# Altium project ETR_CELLMETER_SLAVE.PrjPcb (part 1 of 3)
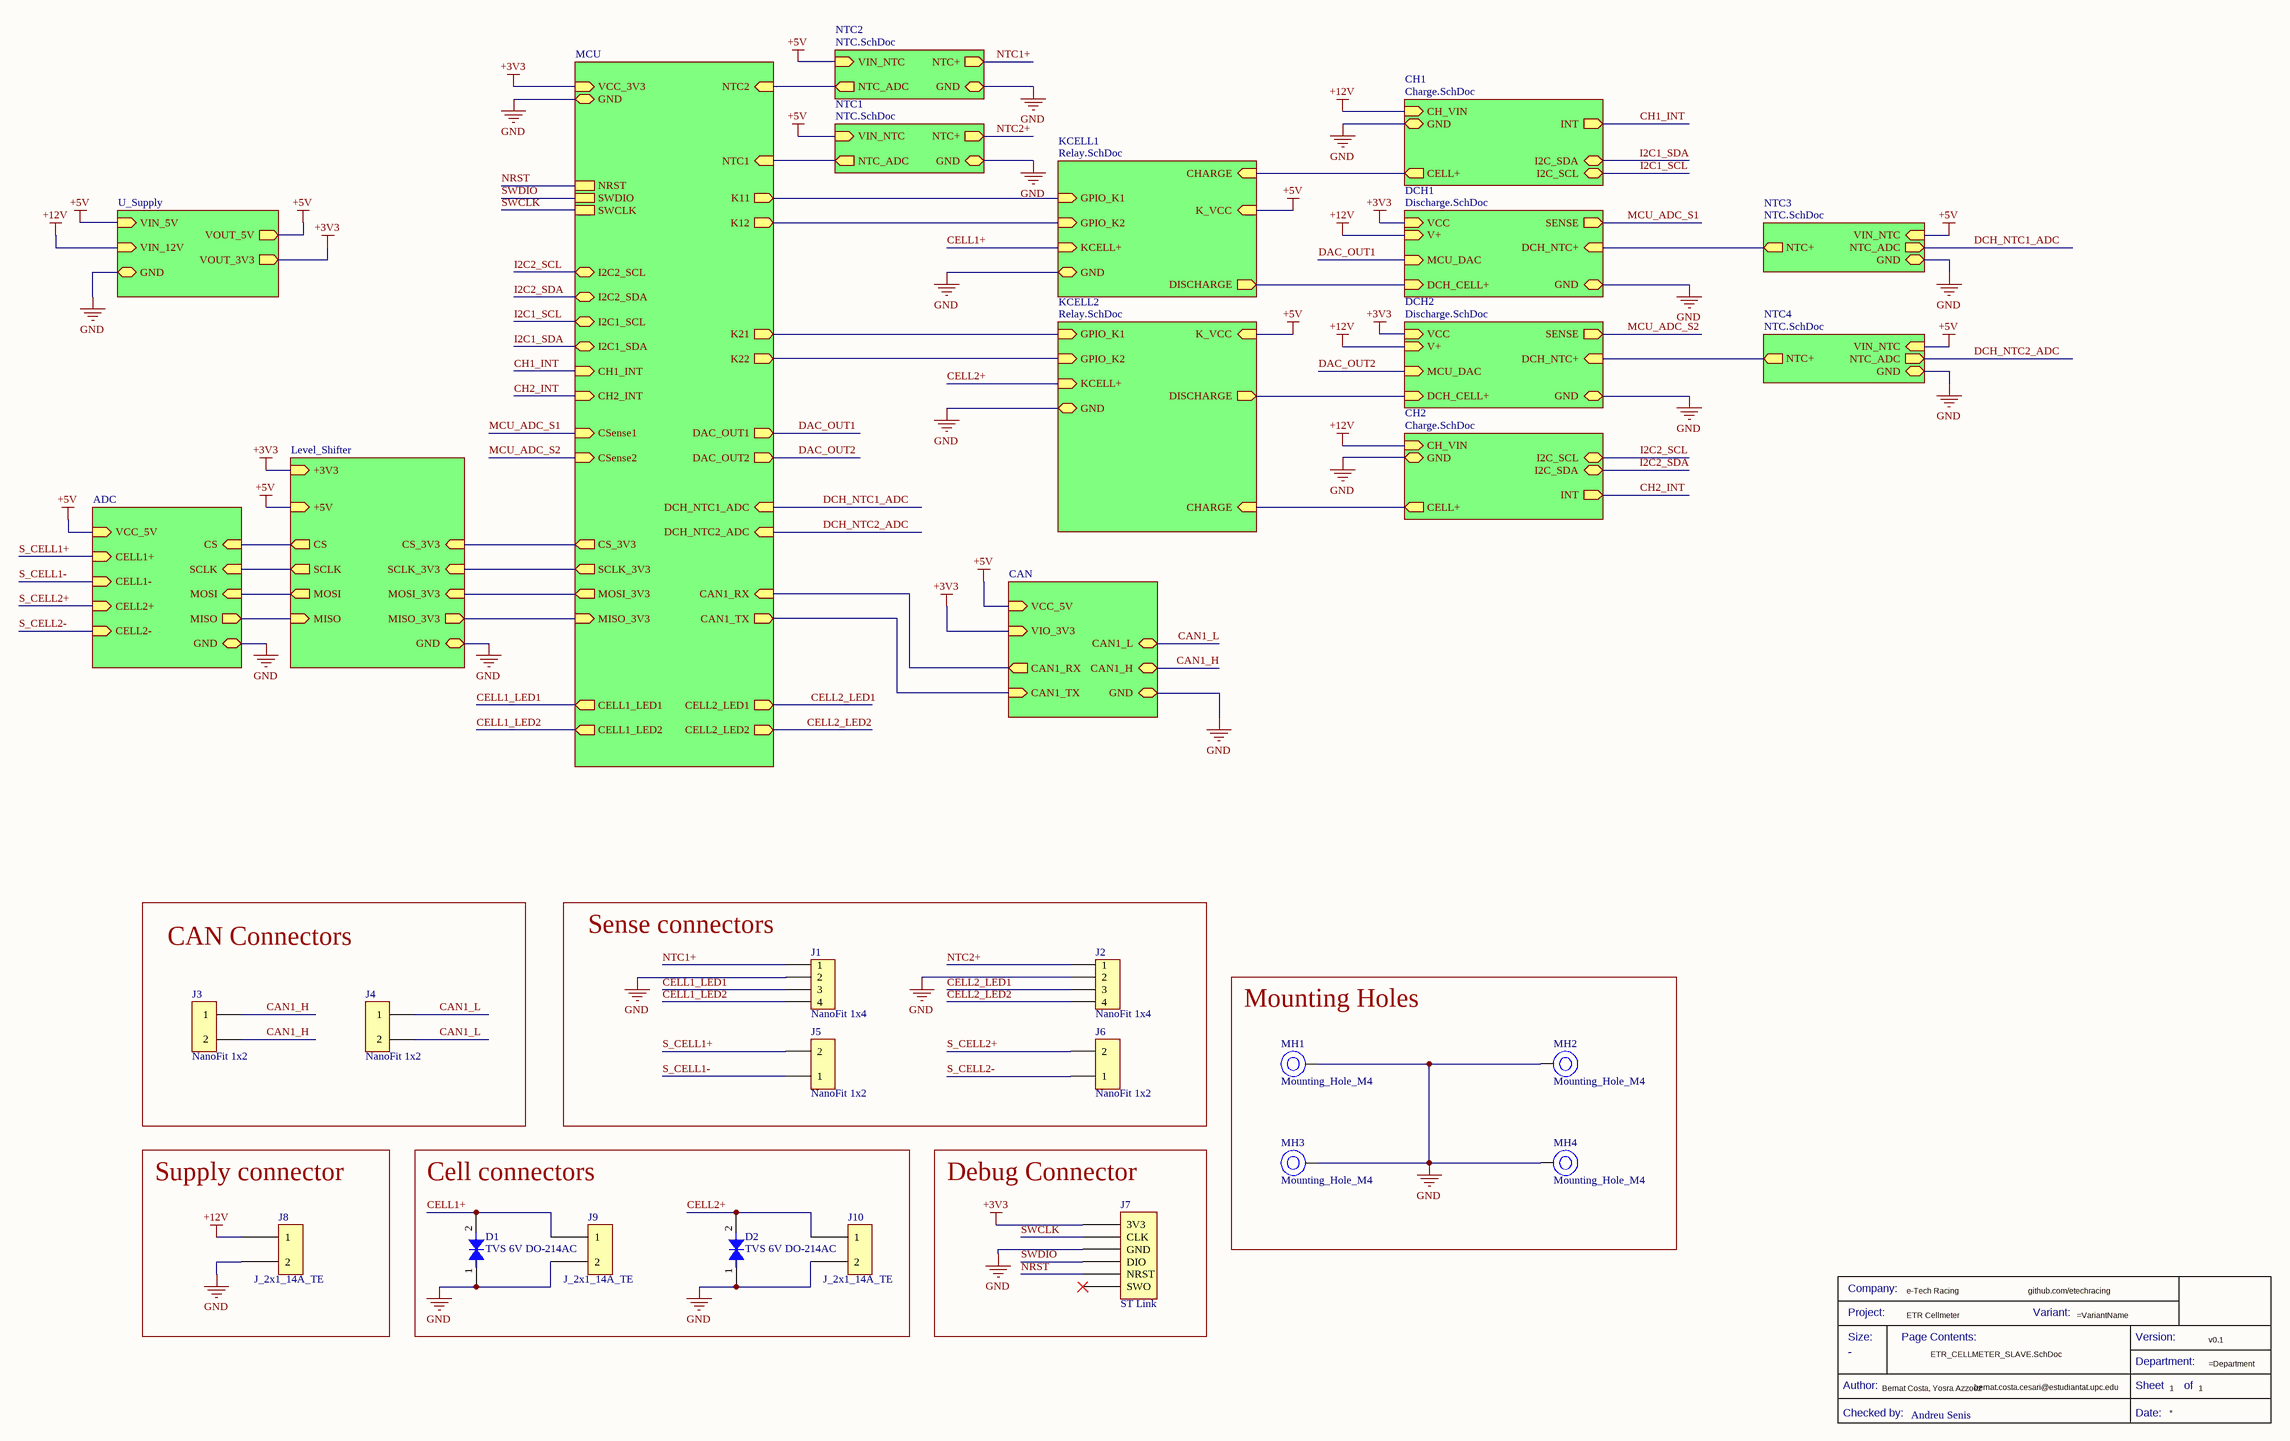
[diagram p0: ETR_CELLMETER_SLAVE.SchDoc]
Company: e-Tech Racing; Date: 08/10/2024; Departament: ECUs; DesignedByURL: github.com/etechracing; DesignerMail: bernat.costa.cesari@estudiantat.upc.edu; DesignerName: Bernat Costa, Yosra Azzouz; Project: ETR Cellmeter; ReviewerName: Andreu Senis; Size: A4; Variant: 0; Version: v0.1
10 sheets, 220 parts. Net scope: strictly hierarchical (ports join the sheet entries above them; power ports are local).
Board file: ETR_CELLMETER_SLAVE.PcbDoc
Sheets:
  ETR_CELLMETER_SLAVE.SchDoc
    ADC = ADC.SchDoc
    Level_Shifter = Level_Shifter.SchDoc
    CAN = CAN.SchDoc
    MCU = MCU.SchDoc
    U_Supply = Supply.SchDoc
    KCELL1 = Relay.SchDoc
    KCELL2 = Relay.SchDoc
    DCH1 = Discharge.SchDoc
    DCH2 = Discharge.SchDoc
    CH2 = Charge.SchDoc
    CH1 = Charge.SchDoc
    NTC1 = NTC.SchDoc
    NTC2 = NTC.SchDoc
    NTC4 = NTC.SchDoc
    NTC3 = NTC.SchDoc

## Sheet ETR_CELLMETER_SLAVE.SchDoc
size A2; SheetNumber: 1; SheetTotal: 1

### Parts
(Parts that share a designator on the sheet are numbered #1, #2 ... from top to bottom, then left to right.)
*#1  Checked by:: Andreu Senis  (hidden comment: Title Block_template)  (graphical)
D1  TVS 6V DO-214AC  [DTVS-DO-214AC]
D2  TVS 6V DO-214AC  [DTVS-DO-214AC]
J1  NanoFit 1x4  [J_NanoFit_1x4_V]
J2  NanoFit 1x4  [J_NanoFit_1x4_V]
J3  NanoFit 1x2  [FP-105309-1102-MFG]
J4  NanoFit 1x2  [FP-105309-1102-MFG]
J5  NanoFit 1x2  [FP-105309-1102-MFG]
J6  NanoFit 1x2  [FP-105309-1102-MFG]
J7  ST Link  [J_STLink_PinHeader]
J8  J_2x1_14A_TE  [179838-2]
J9  J_2x1_14A_TE  [179838-2]
J10  J_2x1_14A_TE  [179838-2]
MH1  Mounting_Hole_M4  [Mounting_Hole_M4]
MH2  Mounting_Hole_M4  [Mounting_Hole_M4]
MH3  Mounting_Hole_M4  [Mounting_Hole_M4]
MH4  Mounting_Hole_M4  [Mounting_Hole_M4]

### Blocks framed on the sheet
CAN Connectors: J3 J4
Sense connectors: J1 J2 J5 J6
Mounting Holes: MH1-MH4
Supply connector: J8
Cell connectors: D1 D2 J9 J10
Debug Connector: J7

### Sub-sheets
ADC = ADC: SCLK (in), CS (in), MOSI (in), MISO (out), CELL2+ (in), CELL2- (in), CELL1- (in), CELL1+ (in), VCC_5V (in), GND (bidir)
CAN = CAN.SchDoc: CAN1_L (bidir), CAN1_H (bidir), CAN1_RX (out), CAN1_TX (in), VCC_5V (in), VIO_3V3 (in), GND (bidir)
CH1 = Charge.SchDoc: CELL+ (out), CH_VIN (in), INT (out), I2C_SCL (bidir), I2C_SDA (bidir), GND (bidir)
CH2 = Charge.SchDoc: CELL+ (out), CH_VIN (in), INT (out), I2C_SCL (bidir), I2C_SDA (bidir), GND (bidir)
DCH1 = Discharge.SchDoc: SENSE (out), VCC (in), V+ (in), MCU_DAC (in), DCH_CELL+ (in), GND (bidir), DCH_NTC+ (in)
DCH2 = Discharge.SchDoc: SENSE (out), VCC (in), V+ (in), MCU_DAC (in), DCH_CELL+ (in), GND (bidir), DCH_NTC+ (in)
KCELL1 = Relay.SchDoc: GPIO_K2 (in), GPIO_K1 (in), KCELL+ (in), DISCHARGE (out), CHARGE (in), GND (bidir), K_VCC (in)
KCELL2 = Relay.SchDoc: GPIO_K2 (in), GPIO_K1 (in), KCELL+ (in), DISCHARGE (out), CHARGE (in), GND (bidir), K_VCC (in)
Level_Shifter = Level_Shifter: MISO_3V3 (out), MOSI (out), CS (out), SCLK (out), CS_3V3 (in), MOSI_3V3 (in), SCLK_3V3 (in), +3V3 (in), +5V (in), MISO (in), GND (bidir)
MCU = MCU: VCC_3V3 (in), NRST, K11 (out), K12 (out), CAN1_RX (in), CAN1_TX (out), K22 (out), K21 (out), CS_3V3 (out), DAC_OUT1 (out), DAC_OUT2 (out), SWDIO, SWCLK, I2C1_SCL (bidir), I2C1_SDA (bidir), SCLK_3V3 (out), MISO_3V3 (in), MOSI_3V3 (out), GND (bidir), NTC1 (in), NTC2 (in), I2C2_SCL (bidir), I2C2_SDA (bidir), CH1_INT (in), CH2_INT (in), CSense1 (in), CSense2 (in), DCH_NTC1_ADC (in), DCH_NTC2_ADC (in), CELL1_LED1 (out), CELL1_LED2 (out), CELL2_LED1 (out), CELL2_LED2 (out)
NTC1 = NTC.SchDoc: VIN_NTC (in), NTC_ADC (out), NTC+ (out), GND (bidir)
NTC2 = NTC.SchDoc: VIN_NTC (in), NTC_ADC (out), NTC+ (out), GND (bidir)
NTC3 = NTC.SchDoc: NTC+ (out), VIN_NTC (in), NTC_ADC (out), GND (bidir)
NTC4 = NTC.SchDoc: NTC+ (out), VIN_NTC (in), NTC_ADC (out), GND (bidir)
U_Supply = Supply.SchDoc: VIN_12V (in), VOUT_5V (out), VOUT_3V3 (out), GND (bidir), VIN_5V (in)

### Nets
+3V3: J7.1(3V3) ; sheet Level_Shifter/+3V3, sheet CAN/VIO_3V3, sheet MCU/VCC_3V3, sheet U_Supply/VOUT_3V3, sheet DCH1/VCC, sheet DCH2/VCC  [project net +3.3V]
+5V: sheet ADC/VCC_5V, sheet Level_Shifter/+5V, sheet CAN/VCC_5V, sheet U_Supply/VOUT_5V, sheet U_Supply/VIN_5V, sheet KCELL1/K_VCC, sheet KCELL2/K_VCC, sheet NTC1/VIN_NTC, sheet NTC2/VIN_NTC, sheet NTC4/VIN_NTC, sheet NTC3/VIN_NTC
+12V: J8.1 ; sheet U_Supply/VIN_12V, sheet DCH1/V+, sheet DCH2/V+, sheet CH2/CH_VIN, sheet CH1/CH_VIN
GND: D1.1 D2.1 J1.2 J2.2 J7.3(GND) J8.2 J9.2 J10.2 MH1.1 MH2.1 MH3.1 MH4.1 ; sheet ADC/GND, sheet Level_Shifter/GND, sheet CAN/GND, sheet MCU/GND, sheet U_Supply/GND, sheet KCELL1/GND, sheet KCELL2/GND, sheet DCH1/GND, sheet DCH2/GND, sheet CH2/GND, sheet CH1/GND, sheet NTC1/GND, sheet NTC2/GND, sheet NTC4/GND, sheet NTC3/GND
CAN1_H: J3.1 J3.2 ; sheet CAN/CAN1_H
CAN1_L: J4.1 J4.2 ; sheet CAN/CAN1_L
CELL1+: D1.2 J9.1 ; sheet KCELL1/KCELL+
CELL1_LED1: J1.3 ; sheet MCU/CELL1_LED1
CELL1_LED2: J1.4 ; sheet MCU/CELL1_LED2
CELL2+: D2.2 J10.1 ; sheet KCELL2/KCELL+
CELL2_LED1: J2.3 ; sheet MCU/CELL2_LED1
CELL2_LED2: J2.4 ; sheet MCU/CELL2_LED2
CH1_INT: sheet MCU/CH1_INT, sheet CH1/INT
CH2_INT: sheet MCU/CH2_INT, sheet CH2/INT
DAC_OUT1: sheet MCU/DAC_OUT1, sheet DCH1/MCU_DAC
DAC_OUT2: sheet MCU/DAC_OUT2, sheet DCH2/MCU_DAC
DCH_NTC1_ADC: sheet MCU/DCH_NTC1_ADC, sheet NTC3/NTC_ADC
DCH_NTC2_ADC: sheet MCU/DCH_NTC2_ADC, sheet NTC4/NTC_ADC
I2C1_SCL: sheet MCU/I2C1_SCL, sheet CH1/I2C_SCL
I2C1_SDA: sheet MCU/I2C1_SDA, sheet CH1/I2C_SDA
I2C2_SCL: sheet MCU/I2C2_SCL, sheet CH2/I2C_SCL
I2C2_SDA: sheet MCU/I2C2_SDA, sheet CH2/I2C_SDA
MCU_ADC_S1: sheet MCU/CSense1, sheet DCH1/SENSE
MCU_ADC_S2: sheet MCU/CSense2, sheet DCH2/SENSE
NRST: J7.5(NRST) ; sheet MCU/NRST
NTC1+: J1.1 ; sheet NTC2/NTC+
NTC2+: J2.1 ; sheet NTC1/NTC+
S_CELL1+: J5.2 ; sheet ADC/CELL1+
S_CELL1-: J5.1 ; sheet ADC/CELL1-
S_CELL2+: J6.2 ; sheet ADC/CELL2+
S_CELL2-: J6.1 ; sheet ADC/CELL2-
SWCLK: J7.2(CLK) ; sheet MCU/SWCLK
SWDIO: J7.4(DIO) ; sheet MCU/SWDIO
NetC401_NTC3_2: sheet DCH1/DCH_NTC+, sheet NTC3/NTC+
NetC401_NTC4_2: sheet DCH2/DCH_NTC+, sheet NTC4/NTC+
NetC402_NTC1_2: sheet MCU/NTC1, sheet NTC1/NTC_ADC
NetC402_NTC2_2: sheet MCU/NTC2, sheet NTC2/NTC_ADC
NetC704_CH1_2: sheet KCELL1/CHARGE, sheet CH1/CELL+
NetC704_CH2_2: sheet KCELL2/CHARGE, sheet CH2/CELL+
NetK301_KCELL1_14: sheet KCELL1/DISCHARGE, sheet DCH1/DCH_CELL+
NetK301_KCELL2_14: sheet KCELL2/DISCHARGE, sheet DCH2/DCH_CELL+
NetR301_KCELL1_1: sheet MCU/K12, sheet KCELL1/GPIO_K2
NetR301_KCELL2_1: sheet MCU/K22, sheet KCELL2/GPIO_K2
NetR303_KCELL1_1: sheet MCU/K11, sheet KCELL1/GPIO_K1
NetR303_KCELL2_1: sheet MCU/K21, sheet KCELL2/GPIO_K1
NetU101_8: sheet ADC/CS, sheet Level_Shifter/CS
NetU101_9: sheet ADC/MOSI, sheet Level_Shifter/MOSI
NetU101_10: sheet ADC/MISO, sheet Level_Shifter/MISO
NetU101_11: sheet ADC/SCLK, sheet Level_Shifter/SCLK
NetU201_2: sheet Level_Shifter/MISO_3V3, sheet MCU/MISO_3V3
NetU201_6: sheet Level_Shifter/SCLK_3V3, sheet MCU/SCLK_3V3
NetU201_16: sheet Level_Shifter/CS_3V3, sheet MCU/CS_3V3
NetU201_18: sheet Level_Shifter/MOSI_3V3, sheet MCU/MOSI_3V3
NetU601#1_1: sheet CAN/CAN1_TX, sheet MCU/CAN1_TX
NetU601#1_4: sheet CAN/CAN1_RX, sheet MCU/CAN1_RX

Not connected (* = marked no-connect by the designer): J7 6(SWO)*

### Notes on the sheet
- (in symbol CMP-00043-7) Company:; Project:; Variant:; Size:; Page Contents:; Version:; Department:; Author:; Sheet; of; Checked by:; Date:

### Library data of the parts
*#1 = CMP-00043-7: Standard Title Block; .Creator: GP; Size: -; Design Item ID: Title Block_template; Category: Title Block; .SCHcheck: GP; Source: e-Tech_Racing.SchLib; .PCBcheck: GP
D1 D2 = CMP-00154-1: TVS diode [Würth Elektronik] 824501600 TVS diode; Manufacturer: Wurth Electronics; Power Line Protection: No; Forward Voltage: 7.02V; Number of Bidirectional Channels: 1; Peak Pulse Current: 38.8A; .Creator: DO; Polarity: Bidirectional; Peak Pulse Power: 400W; Clamping Voltage: 10.3V; ComponentLink2Description: http://www.farnell.com/datasheets/2036401.pdf?src-supplier=Element14; Source: Filter components.SchLib; ComponentLink3URL: https://katalog.we-online.de/pbs/datasheet/824501600.pdf?src-supplier=Digi-Key; Mount: Surface Mount; Design Item ID: DTVS-6V-DO-214AC; ComponentLink3Description: https://katalog.we-online.de/pbs/datasheet/824501600.pdf?src-supplier=Digi-Key; RoHS: Yes; Resistor Type: Zener; REACH SVHC: Unknown; Pins: 2; Min Breakdown Voltage: 7.02V; Min Operating Temperature: -65°C; ComponentLink1URL: https://www.we-online.com/catalog/en/WE-TVSP?sq=824501600#824501600; Reverse Standoff Voltage: 6V; Stock 1: 780; Pricing 1: 1=0,28000, 10=0,26100, 50=0,26100, 100=0,23400, 500=0,20400, 1000=0,17400, 10000=0,17400 (USD); ComponentLink2URL: http://www.farnell.com/datasheets/2036401.pdf?src-supplier=Element14; Category: TVS Diodes; ComponentLink1Description: Where buy it; Manufacturer Part Number: 824501600; Packaging: Cut Tape; RoHS Compliant: Yes; Max Operating Temperature: 150°C
J1 J2 = CMP-00018-1: Nano-Fit Vertical Header Through Hole 2.50mm Pitch Single Row 4 Circuits with Kinked Pins 0.38; Manufacturer 1: Molex; Manufacturer Part Number 1: 105309-1204; .Creator: DO; Pricing 1: 1=1,37050, 10=1,11700, 100=0,95270, 500=0,86980, 1000=0,74060, 2500=0,71930, 5000=0,68450, 10000=0,66860 (USD); ComponentLink2URL: http://www.farnell.com/datasheets/2221349.pdf?src-supplier=Newark; ComponentLink2Description: http://www.farnell.com/datasheets/2221349.pdf?src-supplier=Newark; ComponentLink4URL: http://www.farnell.com/datasheets/2059602.pdf?src-supplier=Element14; ComponentLink3Description: http://www.literature.molex.com/SQLImages/kelmscott/Molex/PDF_Images/987651-1223.PDF?src-supplier=Digi-Key; ComponentLink1URL: http://farnell.com//datasheets/2221349.pdf?src-supplier=Farnell; Source: Electromechanical.SchLib; ComponentLink3URL: http://www.literature.molex.com/SQLImages/kelmscott/Molex/PDF_Images/987651-1223.PDF?src-supplier=Digi-Key; Category: Headers and Wire Housings; Design Item ID: J_NanoFit_1x4_V; ComponentLink4Description: http://www.farnell.com/datasheets/2059602.pdf?src-supplier=Element14; ComponentLink1Description: http://farnell.com//datasheets/2221349.pdf?src-supplier=Farnell; Stock 1: 709; RoHS: No
J3-J6 = CMP-002-00001-2: Conn HDR 2 POS 2.5mm Solder ST Thru-Hole 2 Terminal 1 Port Nano-Fit Tray
J7 = J_STLink_STM32_PinHeader_1x6
J8-J10 = CMP-002-00003-2: 179838-2; Connector Type: Power,Rectangular; Design Item ID: Power 2 pin connector; Mounting Technology: Board; RoHS Compliant: Yes; Max Operating Temperature: 105°C; Source: Electromechanical.SchLib; Min Operating Temperature: -30°C
MH1-MH4 = CMP-00041-8: Mounting Hole M4; Design Item ID: Mounting_Hole_M4; Source: Electromechanical.SchLib

## Sheet ADC.SchDoc
size A3
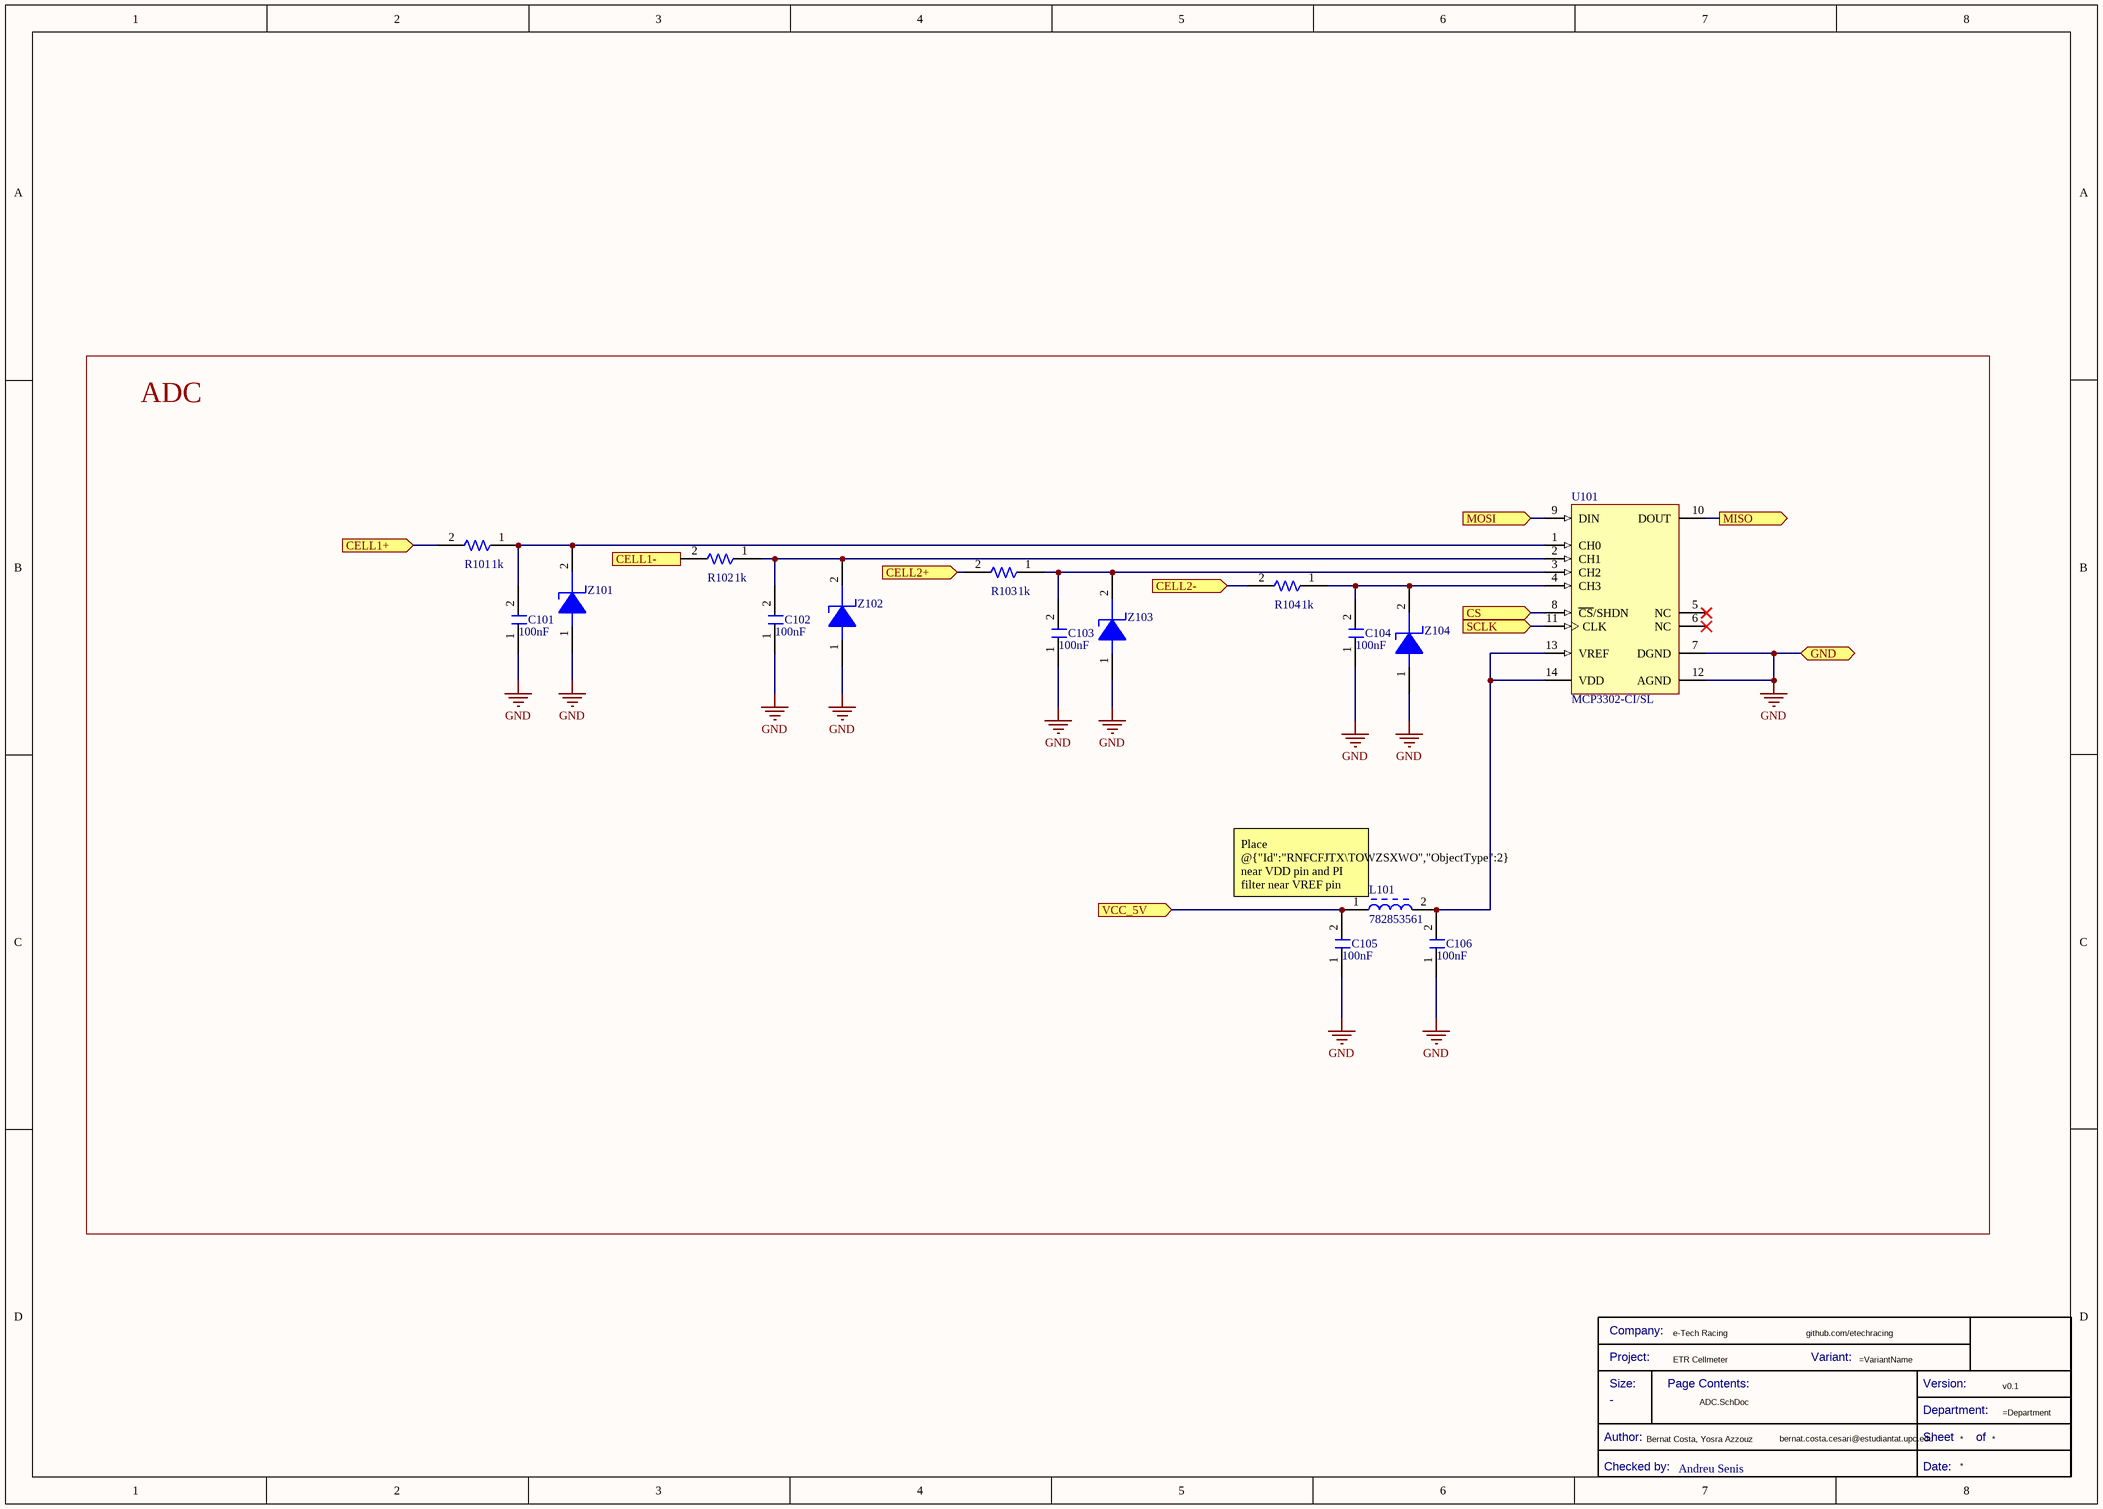
[diagram p1: ADC.SchDoc]

### Parts
(Parts that share a designator on the sheet are numbered #1, #2 ... from top to bottom, then left to right.)
*#2  Checked by:: Andreu Senis  (hidden comment: Title Block_template)  (graphical)
C101  value 100nF  [C0805FNPC-R]  (hidden comment: C100n-50V-0805FNPC-X7R)
C102  value 100nF  [C0805FNPC-R]  (hidden comment: C100n-50V-0805FNPC-X7R)
C103  value 100nF  [C0805FNPC-R]  (hidden comment: C100n-50V-0805FNPC-X7R)
C104  value 100nF  [C0805FNPC-R]  (hidden comment: C100n-50V-0805FNPC-X7R)
C105  value 100nF  [C0805FNPC-R]  (hidden comment: C100n-50V-0805FNPC-X7R)
C106  value 100nF  [C0805FNPC-R]  (hidden comment: C100n-50V-0805FNPC-X7R)
L101  782853561  [L_Ferrite_bead_0805]
R101  value 1k  [0805]  (hidden comment: R1K_0805_0.125W)
R102  value 1k  [0805]  (hidden comment: R1K_0805_0.125W)
R103  value 1k  [0805]  (hidden comment: R1K_0805_0.125W)
R104  value 1k  [0805]  (hidden comment: R1K_0805_0.125W)
U101  MCP3302-CI/SL  [SOIC-SL14_L]
Z101  BZD27B5V1P-M3-08  [SODFL370X108-2N]  (value not drawn)
Z102  BZD27B5V1P-M3-08  [SODFL370X108-2N]  (value not drawn)
Z103  BZD27B5V1P-M3-08  [SODFL370X108-2N]  (value not drawn)
Z104  BZD27B5V1P-M3-08  [SODFL370X108-2N]  (value not drawn)

### Blocks framed on the sheet
ADC: C101-C106 L101 R101-R104 U101 Z101-Z104

### Ports
CELL1+ (in), CELL1- (in), CELL2+ (in), CELL2- (in), CS (in), GND (bidir), MISO (out), MOSI (in), SCLK (in), VCC_5V (in)

### Nets
+5V: C105.2 L101.1 ; port VCC_5V
GND: C101.1 C102.1 C103.1 C104.1 C105.1 C106.1 U101.7(DGND) U101.12(AGND) Z101.1 Z102.1 Z103.1 Z104.1 ; port GND
S_CELL1+: R101.2 ; port CELL1+
S_CELL1-: R102.2 ; port CELL1-
S_CELL2+: R103.2 ; port CELL2+
S_CELL2-: R104.2 ; port CELL2-
NetC101_2: C101.2 R101.1 U101.1(CH0) Z101.2
NetC102_2: C102.2 R102.1 U101.2(CH1) Z102.2
NetC103_2: C103.2 R103.1 U101.3(CH2) Z103.2
NetC104_2: C104.2 R104.1 U101.4(CH3) Z104.2
NetC106_2: C106.2 L101.2 U101.13(VREF) U101.14(VDD)
NetU101_8: U101.8(~{CS}/SHDN) ; port CS
NetU101_9: U101.9(DIN) ; port MOSI
NetU101_10: U101.10(DOUT) ; port MISO
NetU101_11: U101.11(CLK) ; port SCLK

Not connected (* = marked no-connect by the designer): U101 5(NC)* 6(NC)*

### Notes on the sheet
- (near L101) Place @{"Id":"RNFCFJTX\TOWZSXWO","ObjectType":2} near VDD pin and PI filter near VREF pin
- (in symbol Title Block_template) Company:; Project:; Variant:; Size:; Page Contents:; Version:; Department:; Author:; Sheet; of; Checked by:; Date:

### Library data of the parts
*#2 = Title Block_template: Standard Title Block; .Creator: GP; Category: Title Block; .PCBcheck: GP; .SCHcheck: GP; Size: -
C101-C106 = CMP-00063-1: Cap, 0.1ΜF, 50V, 10%, X7R, 0805; Manufacturer 1: Wurth Electronics; Manufacturer Part Number 1: 885012207098; .Creator: DR; Pricing 1: 100=0,10200, 500=0,07100, 2000=0,06100 (GBP); ComponentLink1URL: http://www.farnell.com/datasheets/1958498.pdf?src-supplier=Farnell; Design Item ID: C100n-50V-0805FNPC-X7R; Voltage Rating (DC): 50V; Voltage Rating: 50V; Max Operating Temperature: 125°C; RoHS: Yes; Case Code (Metric): 2012; Mount: Surface Mount; REACH SVHC: Unknown; Stock 1: 8000; Source: Passives.SchLib; Tolerance: 10%; RoHS Compliant: Yes; Dielectric: X7R; ComponentLink2Description: http://www.farnell.com/datasheets/1958498.pdf?src-supplier=Element14; ComponentLink2URL: http://www.farnell.com/datasheets/1958498.pdf?src-supplier=Element14; Min Operating Temperature: -55°C; Width: 0.049inch; Category: Ceramic Capacitors; Thickness: 0.035inch; Length: 0.079inch; ComponentLink3URL: https://katalog.we-online.de/pbs/datasheet/885012207098.pdf?src-supplier=Digi-Key; Case/Package: 0805; ComponentLink3Description: https://katalog.we-online.de/pbs/datasheet/885012207098.pdf?src-supplier=Digi-Key; Packaging: Cut Tape; ComponentLink1Description: http://www.farnell.com/datasheets/1958498.pdf?src-supplier=Farnell; ComponentLink4Description: http://www.farnell.com/datasheets/1958498.pdf?src-supplier=Newark; ComponentLink4URL: http://www.farnell.com/datasheets/1958498.pdf?src-supplier=Newark
L101 = CMP-00166-1: Manufacturer Part Number: BLM18EG331TN1D; Manufacturer: Murata; .Creator: GP; Tolerance: 25%; Core Material: Ferrite; Impedance: 330R; Max DC Current: 500mA; Resistance: 0.21; Number of Circuits: 1; DC Resistance (DCR): 210mR; Material: Ferrite,Steel; Test Frequency: 100MHz; RoHS: Yes; Case Code (Metric): 1608; ComponentLink6URL: https://datasheet.ciiva.com/3082/l0110s0101blm18e-3082714.pdf?src-supplier=Avnet; ComponentLink7URL: https://datasheet.ciiva.com/6211/l0110s0101blm18e-6211470.pdf?src-supplier=Digi-Key; Width: 0.8mm; ComponentLink6Description: https://datasheet.ciiva.com/3082/l0110s0101blm18e-3082714.pdf?src-supplier=Avnet; Series: BLM18E; Stock 1: 20037; Packaging: Tape and Reel; Max Operating Temperature: 125°C; Case/Package: 0603; ComponentLink8URL: https://datasheet.ciiva.com/6211/l0110s0101blm18e-6211471.pdf?src-supplier=Digi-Key; Case Code (Imperial): 0603; Lead Free: Lead Free; ComponentLink3Description: https://datasheet.ciiva.com/41449/001172267-da-01-en-drossel-0603-330r-1-6x0-8mm-4000st-41449581.pdf?src-supplier=Conrad; Height: 0.8mm; REACH SVHC: No SVHC; ComponentLink1URL: https://datasheet.ciiva.com/1467/5169-1467232.pdf?src-supplier=Element14; Number of Pins: 2; Source: Filter components.SchLib; ComponentLink1Description: https://datasheet.ciiva.com/1467/5169-1467232.pdf?src-supplier=Element14; Depth: 0.8mm; Termination: SMD/SMT; Package Quantity: 1; Min Operating Temperature: -55°C; ComponentLink7Description: https://datasheet.ciiva.com/6211/l0110s0101blm18e-6211470.pdf?src-supplier=Digi-Key; Design Item ID: L_Ferrite_bead_782853561; Length: 1.6mm; ComponentLink4Description: https://datasheet.ciiva.com/1467/5169-1467233.pdf?src-supplier=Element14; ComponentLink8Description: https://datasheet.ciiva.com/6211/l0110s0101blm18e-6211471.pdf?src-supplier=Digi-Key; Current Rating: 500mA; RoHS Compliant: Yes; ComponentLink2Description: https://datasheet.ciiva.com/11795/0900766b811b5866-11795405.pdf?src-supplier=RSComponents; Number of Lines: 1; ComponentLink2URL: https://datasheet.ciiva.com/11795/0900766b811b5866-11795405.pdf?src-supplier=RSComponents; Pricing 1: 1=0,23000, 10=0,17500, 25=0,14520, 50=0,12520, 100=0,11260, 250=0,09508, 500=0,08508, 1000=0,07257 (USD); Max Current Rating: 500mA; ComponentLink5URL: https://datasheet.ciiva.com/1561/5169-1561345.pdf?src-supplier=Newark; ComponentLink4URL: https://datasheet.ciiva.com/1467/5169-1467233.pdf?src-supplier=Element14; Category: Ferrite Beads and Chips; ComponentLink3URL: https://datasheet.ciiva.com/41449/001172267-da-01-en-drossel-0603-330r-1-6x0-8mm-4000st-41449581.pdf?src-supplier=Conrad; ComponentLink5Description: https://datasheet.ciiva.com/1561/5169-1561345.pdf?src-supplier=Newark
R101-R104 = CMP-009-00019-4: Fixed Resistor, Thin Film, 0.125W, 1000ohm, 150V, 0.1% +/-Tol, 15ppm/Cel, Surface Mount, 0805; Power: 125mW; RoHS Compliant: Yes; Case/Package: 0805; Mounting Technology: Surface Mount; Min Operating Temperature: -55°C; Tolerance: 0.1%; Pins: 2; Max Operating Temperature: 125°C
U101 = CMP-031-00009-1: ADC, Successive Approximation, 13-Bit, 1 Func, 4 Channel, Serial Access, PDSO14; RoHS Compliant: Yes; Case/Package: SOP; Max Operating Temperature: 85°C; Min Operating Temperature: -40°C; Pins: 14
Z101-Z104 = CMP-004-00008-1: Zener Diode, 5.1V V(Z), 2%, 0.8W, Silicon, Unidirectional, DO-219AB; RoHS Compliant: Yes; Pins: 2; Max Operating Temperature: 175°C; Min Operating Temperature: -65°C

## Sheet Level_Shifter.SchDoc
size A4
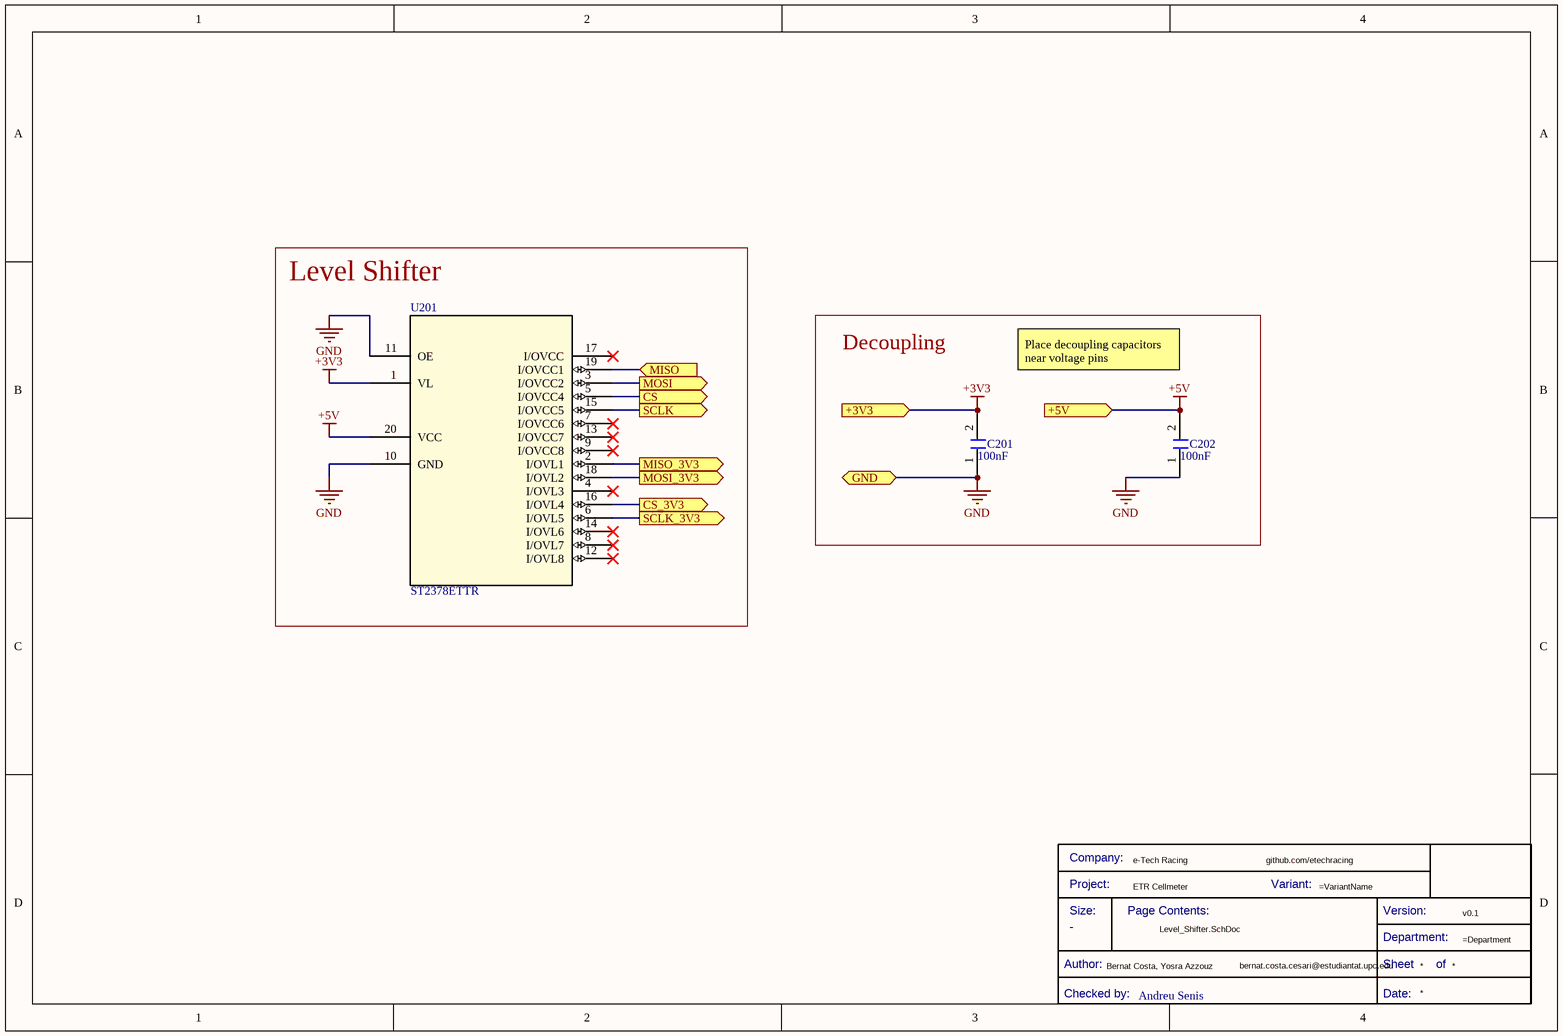
[diagram p2: Level_Shifter.SchDoc]

### Parts
(Parts that share a designator on the sheet are numbered #1, #2 ... from top to bottom, then left to right.)
*#3  Checked by:: Andreu Senis  (hidden comment: Title Block_template)  (graphical)
C201  value 100nF  [C0805FNPC-R]  (hidden comment: C100n-50V-0805FNPC-X7R)
C202  value 100nF  [C0805FNPC-R]  (hidden comment: C100n-50V-0805FNPC-X7R)
U201  ST2378ETTR  [TSSOP20_4P4X6P5_STM]

### Blocks framed on the sheet
Level Shifter: U201
Decoupling: C201 C202

### Ports
+3V3 (in), +5V (in), CS (out), CS_3V3 (out), GND (bidir), MISO (in), MISO_3V3 (out), MOSI (out), MOSI_3V3 (out), SCLK (out), SCLK_3V3 (out)

### Nets
+3V3: C201.2 U201.1(VL) ; port +3V3  [project net +3.3V]
+5V: C202.2 U201.20(VCC) ; port +5V
GND: C201.1 C202.1 U201.10(GND) U201.11(OE) ; port GND
NetU101_8: U201.5(I/OVCC4) ; port CS
NetU101_9: U201.3(I/OVCC2) ; port MOSI
NetU101_10: U201.19(I/OVCC1) ; port MISO
NetU101_11: U201.15(I/OVCC5) ; port SCLK
NetU201_2: U201.2(I/OVL1) ; port MISO_3V3
NetU201_6: U201.6(I/OVL5) ; port SCLK_3V3
NetU201_16: U201.16(I/OVL4) ; port CS_3V3
NetU201_18: U201.18(I/OVL2) ; port MOSI_3V3

Not connected (* = marked no-connect by the designer): U201 4(I/OVL3)* 7(I/OVCC6)* 8(I/OVL7)* 9(I/OVCC8)* 12(I/OVL8)* 13(I/OVCC7)* 14(I/OVL6)* 17(I/OVCC)*

### Notes on the sheet
- Place decoupling capacitors near voltage pins
- (in symbol Title Block_template) Company:; Project:; Variant:; Size:; Page Contents:; Version:; Department:; Author:; Sheet; of; Checked by:; Date:

### Library data of the parts
*#3 = Title Block_template: Standard Title Block; .Creator: GP; Category: Title Block; .PCBcheck: GP; .SCHcheck: GP; Size: -
C201 C202 = CMP-00063-1: as C101 on sheet ADC; Pricing 1: 100=0,10200, 500=0,07100, 2000=0,06100 (GBP); ComponentLink1URL: http://www.farnell.com/datasheets/1958498.pdf?src-supplier=Farnell; Design Item ID: C100n-50V-0805FNPC-X7R; Voltage Rating (DC): 50V; Voltage Rating: 50V; Max Operating Temperature: 125°C; RoHS: Yes; Case Code (Metric): 2012; Mount: Surface Mount; REACH SVHC: Unknown; Stock 1: 8000; Source: Passives.SchLib; Tolerance: 10%; RoHS Compliant: Yes; Dielectric: X7R; ComponentLink2Description: http://www.farnell.com/datasheets/1958498.pdf?src-supplier=Element14; ComponentLink2URL: http://www.farnell.com/datasheets/1958498.pdf?src-supplier=Element14; Min Operating Temperature: -55°C; Width: 0.049inch; Category: Ceramic Capacitors; Thickness: 0.035inch; Length: 0.079inch; ComponentLink3URL: https://katalog.we-online.de/pbs/datasheet/885012207098.pdf?src-supplier=Digi-Key; Case/Package: 0805; ComponentLink3Description: https://katalog.we-online.de/pbs/datasheet/885012207098.pdf?src-supplier=Digi-Key; Packaging: Cut Tape; ComponentLink1Description: http://www.farnell.com/datasheets/1958498.pdf?src-supplier=Farnell; ComponentLink4Description: http://www.farnell.com/datasheets/1958498.pdf?src-supplier=Newark; ComponentLink4URL: http://www.farnell.com/datasheets/1958498.pdf?src-supplier=Newark
U201 = CMP-00203-1: No Description Available; Mfr_Name: STMicroelectronics; RefDes: RefDes; Source: ST2378ETTR.SchLib; Type: Type; Design Item ID: ST2378ETTR

## Sheet CAN.SchDoc
size A4
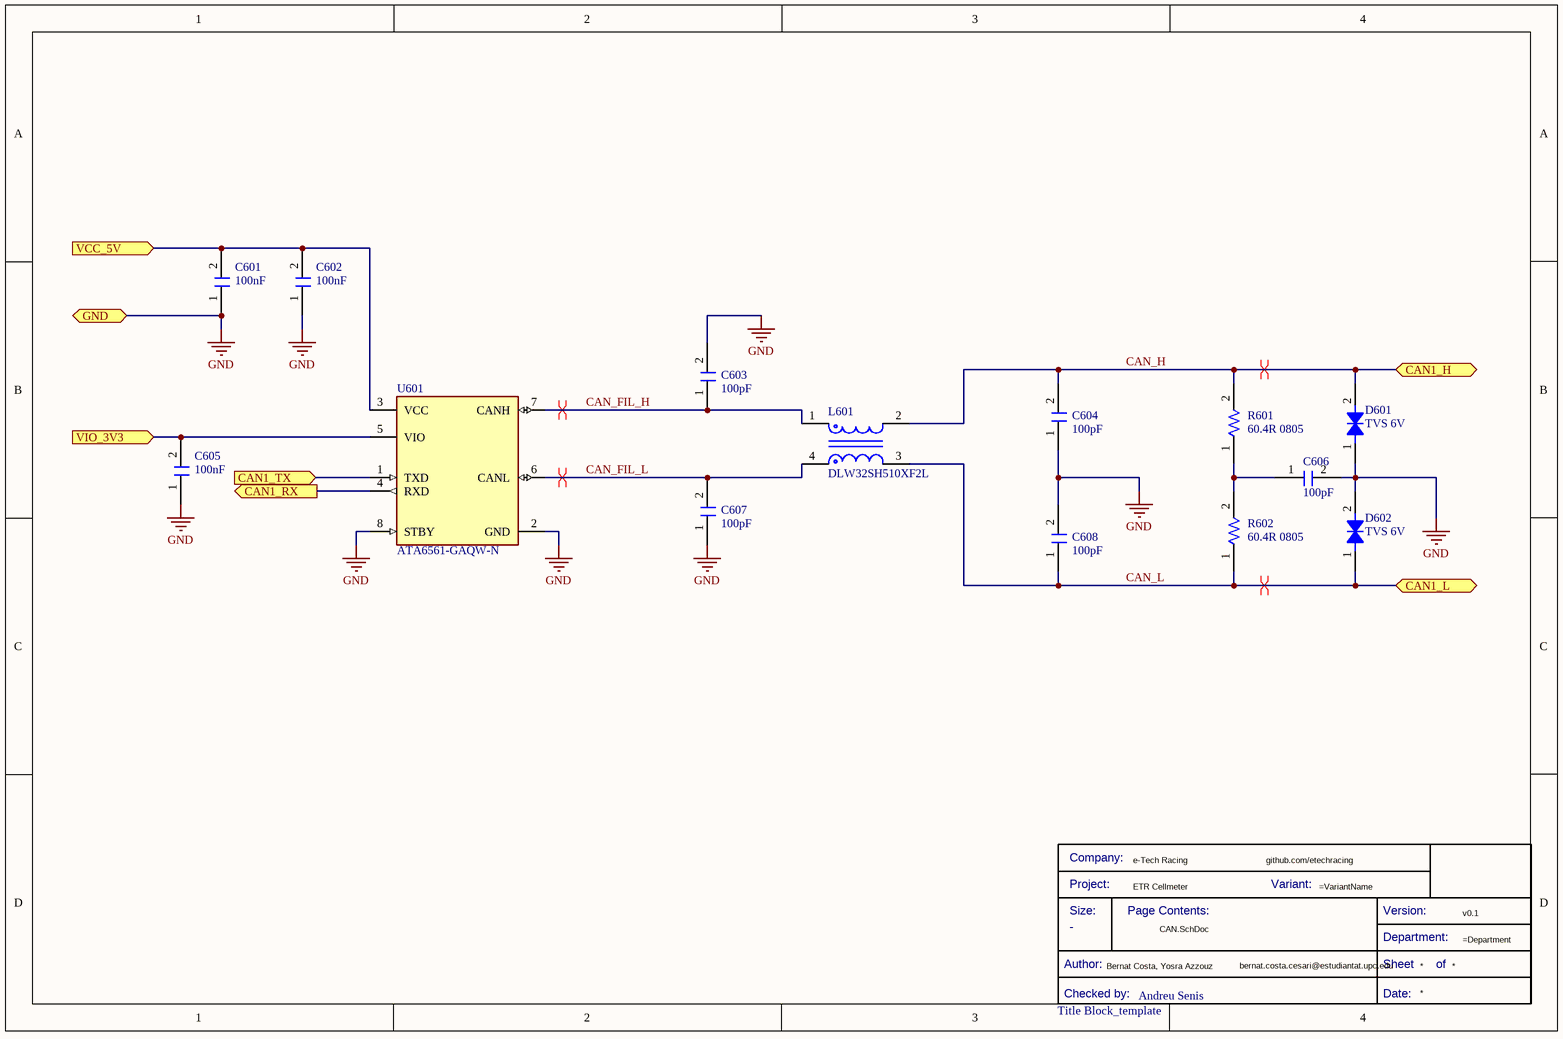
[diagram p3: CAN.SchDoc]

### Parts
(Parts that share a designator on the sheet are numbered #1, #2 ... from top to bottom, then left to right.)
*#4  Title Block_template  Checked by:: Andreu Senis  (graphical)
C601#1  value 100nF  [C0805FNPC-R]  (hidden comment: C100n-50V-0805FNPC-X7R)
C602#1  value 100nF  [C0805FNPC-R]  (hidden comment: C100n-50V-0805FNPC-X7R)
C603#1  value 100pF  [C0805FNPC-W]  (hidden comment: C100p-50V-0805FNPC-C0G/NP0)
C604#1  value 100pF  [C0805FNPC-W]  (hidden comment: C100p-50V-0805FNPC-C0G/NP0)
C605#1  value 100nF  [C0805FNPC-R]  (hidden comment: C100n-50V-0805FNPC-X7R)
C606#1  value 100pF  [C0805FNPC-W]  (hidden comment: C100p-50V-0805FNPC-C0G/NP0)
C607#1  value 100pF  [C0805FNPC-W]  (hidden comment: C100p-50V-0805FNPC-C0G/NP0)
C608#1  value 100pF  [C0805FNPC-W]  (hidden comment: C100p-50V-0805FNPC-C0G/NP0)
D601#1  TVS 6V  [DTVS-DO-214AC]
D602#1  TVS 6V  [DTVS-DO-214AC]
L601#1  DLW32SH510XF2L  [FP-DLW32PH-MFG]
R601#1  value 60.4R 0805  [R0805FTK]  (hidden comment: R60-0805FTN)
R602#1  value 60.4R 0805  [R0805FTK]  (hidden comment: R60-0805FTN)
U601#1  ATA6561-GAQW-N  [FP-C04-057-OA-MFG]

### Ports
CAN1_H (bidir), CAN1_L (bidir), CAN1_RX (out), CAN1_TX (in), GND (bidir), VCC_5V (in), VIO_3V3 (in)

### Nets
+3.3V: C605#1.2 U601#1.5(VIO) ; port VIO_3V3
+5V: C601#1.2 C602#1.2 U601#1.3(VCC) ; port VCC_5V
GND: C601#1.1 C602#1.1 C603#1.2 C604#1.1 C605#1.1 C606#1.2 C607#1.1 C608#1.2 D601#1.1 D602#1.2 U601#1.2(GND) U601#1.8(STBY) ; port GND
CAN_FIL_H: C603#1.1 L601#1.1 U601#1.7(CANH)
CAN_FIL_L: C607#1.2 L601#1.4 U601#1.6(CANL)
CAN_H: C604#1.2 D601#1.2 L601#1.2 R601#1.2 ; port CAN1_H  [project net CAN1_H]
CAN_L: C608#1.1 D602#1.1 L601#1.3 R602#1.1 ; port CAN1_L  [project net CAN1_L]
NetC606#1_1: C606#1.1 R601#1.1 R602#1.2
NetU601#1_1: U601#1.1(TXD) ; port CAN1_TX
NetU601#1_4: U601#1.4(RXD) ; port CAN1_RX

### Layout directives
differential pair: CAN1_H, CAN1_L, CAN_FIL_H, CAN_FIL_L

### Notes on the sheet
- (in symbol CMP-00043-2) Company:; Project:; Variant:; Size:; Page Contents:; Version:; Department:; Author:; Sheet; of; Checked by:; Date:

### Library data of the parts
*#4 = CMP-00043-2: Standard Title Block; .Creator: GP; Size: -; Design Item ID: Title Block_template; Category: Title Block; .PCBcheck: GP; Source: e-Tech_Racing.SchLib; .SCHcheck: GP
C601#1 C602#1 C605#1 = CMP-00063-1: as C101 on sheet ADC; Pricing 1: 100=0,10200, 500=0,07100, 2000=0,06100 (GBP); ComponentLink1URL: http://www.farnell.com/datasheets/1958498.pdf?src-supplier=Farnell; Design Item ID: C100n-50V-0805FNPC-X7R; Voltage Rating (DC): 50V; Voltage Rating: 50V; Max Operating Temperature: 125°C; RoHS: Yes; Case Code (Metric): 2012; Mount: Surface Mount; REACH SVHC: Unknown; Stock 1: 8000; Source: Passives.SchLib; Tolerance: 10%; RoHS Compliant: Yes; Dielectric: X7R; ComponentLink2Description: http://www.farnell.com/datasheets/1958498.pdf?src-supplier=Element14; ComponentLink2URL: http://www.farnell.com/datasheets/1958498.pdf?src-supplier=Element14; Min Operating Temperature: -55°C; Width: 0.049inch; Category: Ceramic Capacitors; Thickness: 0.035inch; Length: 0.079inch; ComponentLink3URL: https://katalog.we-online.de/pbs/datasheet/885012207098.pdf?src-supplier=Digi-Key; Case/Package: 0805; ComponentLink3Description: https://katalog.we-online.de/pbs/datasheet/885012207098.pdf?src-supplier=Digi-Key; Packaging: Cut Tape; ComponentLink1Description: http://www.farnell.com/datasheets/1958498.pdf?src-supplier=Farnell; ComponentLink4Description: http://www.farnell.com/datasheets/1958498.pdf?src-supplier=Newark; ComponentLink4URL: http://www.farnell.com/datasheets/1958498.pdf?src-supplier=Newark
C603#1 C604#1 C606#1 C607#1 C608#1 = CMP-00068-1: Multilayer Ceramic Capacitor, Wcap-Csgp Series, 100 Pf, 5%, C0G / Np0, 50 V, 0805 [2012 Metric] Rohs Compliant: Yes; Manufacturer Part Number: 885012007057; Manufacturer: Wurth Electronics; Voltage Rating (DC): 50V; .Creator: DR; Pricing 1: 4000=0,03900, 12000=0,03800 (USD); Case/Package: 0805; Packaging: Cut Tape; ComponentLink3URL: http://www.farnell.com/datasheets/1958443.pdf?src-supplier=Element14; Dielectric: C0G; Design Item ID: C100p-50V-0805FNPC-C0G/NP0; ComponentLink2URL: https://katalog.we-online.de/pbs/datasheet/885012007057.pdf?src-supplier=Digi-Key; Length: 0.079inch; Case Code (Metric): 2012; Stock 1: 1; ComponentLink1URL: http://www.farnell.com/datasheets/1958443.pdf?src-supplier=Farnell; Category: Ceramic Capacitors; ComponentLink5URL: https://www.we-online.com/catalog/en/WCAP-CSGP-50VDC#885012007057; Mount: Surface Mount; Thickness: 0.035inch; ComponentLink4Description: http://www.farnell.com/datasheets/1958443.pdf?src-supplier=Newark; REACH SVHC: Unknown; ComponentLink3Description: http://www.farnell.com/datasheets/1958443.pdf?src-supplier=Element14; Source: Passives.SchLib; ComponentLink1Description: http://www.farnell.com/datasheets/1958443.pdf?src-supplier=Farnell; ComponentLink5Description: Where buy it; RoHS Compliant: Yes; ComponentLink2Description: https://katalog.we-online.de/pbs/datasheet/885012007057.pdf?src-supplier=Digi-Key; Width: 0.049inch; ComponentLink4URL: http://www.farnell.com/datasheets/1958443.pdf?src-supplier=Newark; Voltage Rating: 50V; Min Operating Temperature: -55°C; Max Operating Temperature: 125°C; Tolerance: 5%; RoHS: Yes
D601#1 D602#1 = CMP-00154-1: as D1 on sheet ETR_CELLMETER_SLAVE; ComponentLink2Description: http://www.farnell.com/datasheets/2036401.pdf?src-supplier=Element14; Source: Filter components.SchLib; ComponentLink3URL: https://katalog.we-online.de/pbs/datasheet/824501600.pdf?src-supplier=Digi-Key; Mount: Surface Mount; Design Item ID: DTVS-6V-DO-214AC; ComponentLink3Description: https://katalog.we-online.de/pbs/datasheet/824501600.pdf?src-supplier=Digi-Key; RoHS: Yes; Resistor Type: Zener; REACH SVHC: Unknown; Pins: 2; Min Breakdown Voltage: 7.02V; Min Operating Temperature: -65°C; ComponentLink1URL: https://www.we-online.com/catalog/en/WE-TVSP?sq=824501600#824501600; Reverse Standoff Voltage: 6V; Stock 1: 780; Pricing 1: 1=0,28000, 10=0,26100, 50=0,26100, 100=0,23400, 500=0,20400, 1000=0,17400, 10000=0,17400 (USD); ComponentLink2URL: http://www.farnell.com/datasheets/2036401.pdf?src-supplier=Element14; Category: TVS Diodes; ComponentLink1Description: Where buy it; Manufacturer Part Number: 824501600; Packaging: Cut Tape; RoHS Compliant: Yes; Max Operating Temperature: 150°C
L601#1 = CMP-006-00001-1: Cmc 51UH 200MA 2LN SMD AEC-Q200
R601#1 R602#1 = CMP-00080-1: Res Thin Film 0805 60.4 Ohm 0.1% 1/8W ±25ppm/°C Molded SMD SMD Punched Carrier T/R; Manufacturer 1: Panasonic; Manufacturer Part Number 1: ERA-6AEB60R4V; Voltage Rating (DC): 100V; Power Rating: 125mW; Voltage Rating: 200V; .Creator: DR; Lead Free: Lead Free; ComponentLink4URL: https://datasheet.ciiva.com/30184/54aoa0000ce26-30184022.pdf?src-supplier=Onlinecomponents.com; Source: Passives.SchLib; Radiation Hardening: No; ComponentLink5Description: https://datasheet.ciiva.com/9188/aoa0000ce26-9188476.pdf?src-supplier=Avnet; Depth: 1.25mm; Length: 2mm; ComponentLink3Description: https://datasheet.ciiva.com/5951/485442-5951173.pdf?src-supplier=Farnell; RoHS: Yes; Tolerance: 0.1%; Termination: SMD/SMT; ComponentLink1Description: https://datasheet.ciiva.com/11811/0900766b80eb1d8c-11811180.pdf?src-supplier=RSComponents; Max Power Dissipation: 125mW; Package Quantity: 5000; Mount: Surface Mount; Number of Terminations: 2; Temperature Coefficient: 25ppm/°C; Case/Package: 0805; Packaging: Tape and Reel; Contact Plating: Tin; Category: Chip SMD Resistors; ComponentLink1URL: https://datasheet.ciiva.com/11811/0900766b80eb1d8c-11811180.pdf?src-supplier=RSComponents; Features: Automotive AEC-Q200; Weight: 0.000194oz; Resistor Type: Thin Film,Metal Film; Design Item ID: R60-0805FTN; Stock 1: 5000; Case Code (Metric): 2012; ComponentLink2Description: https://datasheet.ciiva.com/41450/001181146-da-01-en-widerstand-era-0805-60r4-0-1-5000st-41450303.pdf?src-supplier=Conrad; ComponentLink4Description: https://datasheet.ciiva.com/30184/54aoa0000ce26-30184022.pdf?src-supplier=Onlinecomponents.com; ComponentLink3URL: https://datasheet.ciiva.com/5951/485442-5951173.pdf?src-supplier=Farnell; Max Operating Temperature: 155°C; Pricing 1: 1=0,04650, 10=0,03900, 100=0,02860 (USD); ComponentLink2URL: https://datasheet.ciiva.com/41450/001181146-da-01-en-widerstand-era-0805-60r4-0-1-5000st-41450303.pdf?src-supplier=Conrad; ComponentLink5URL: https://datasheet.ciiva.com/9188/aoa0000ce26-9188476.pdf?src-supplier=Avnet; Min Operating Temperature: -55°C; Pins: 2; Width: 1.25mm; Height: 0.5mm
U601#1 = CMP-015-00000-1: CAN Transceiver, 1-Trnsvr, PDSO8; RoHS Compliant: Yes

## Sheet MCU.SchDoc
size A3
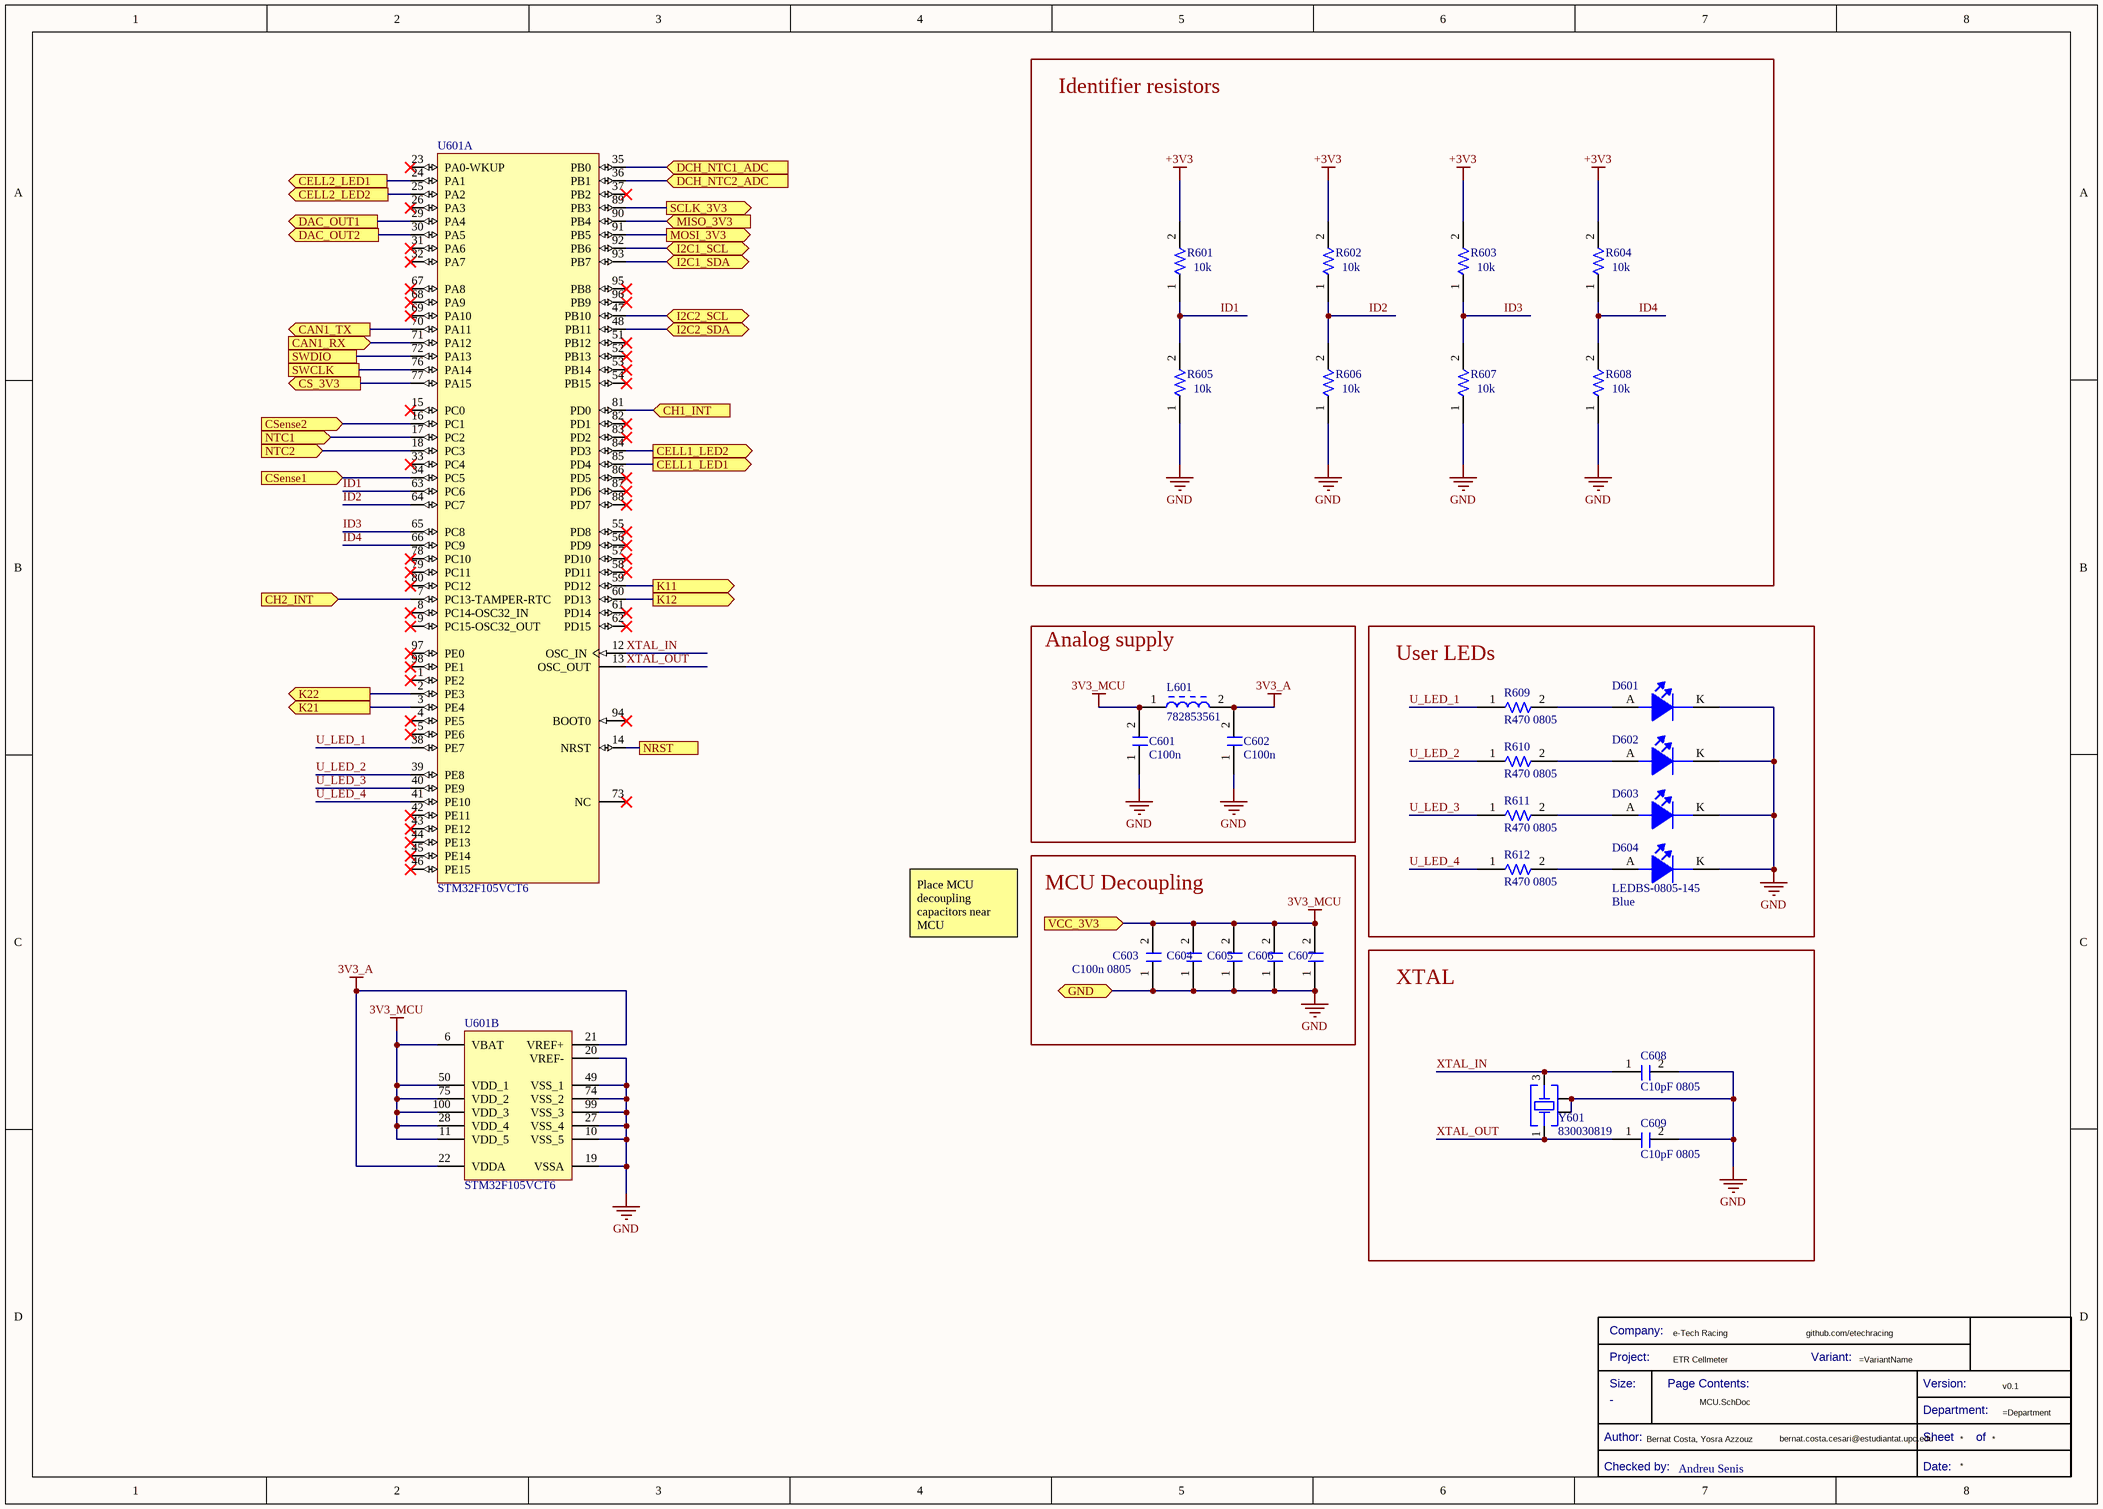
[diagram p4: MCU.SchDoc]

### Parts
(Parts that share a designator on the sheet are numbered #1, #2 ... from top to bottom, then left to right.)
*#5  Checked by:: Andreu Senis  (hidden comment: Title Block_template)  (graphical)
C601#2  C100n  [C0805FNPC-R]
C602#2  C100n  [C0805FNPC-R]
C603#2  C100n-50V-0805FNPC-X7R  [C0805FNPC-R]  (value not drawn)
C604#2  C100n-50V-0805FNPC-X7R  [C0805FNPC-R]  (value not drawn)
C605#2  C100n-50V-0805FNPC-X7R  [C0805FNPC-R]  (value not drawn)
C606#2  C100n-50V-0805FNPC-X7R  [C0805FNPC-R]  (value not drawn)
C607#2  C100n 0805  [C0805FNPC-R]
C608#2  C10pF 0805  [WCAP-CSGP_0805_L2W1.25H0.6_Reflow]
C609  C10pF 0805  [WCAP-CSGP_0805_L2W1.25H0.6_Reflow]
D601#2  LEDBS-0805-145  [LED_0805_WE]  (value not drawn)
D602#2  LEDBS-0805-145  [LED_0805_WE]  (value not drawn)
D603  LEDBS-0805-145  [LED_0805_WE]  (value not drawn)
D604  LEDBS-0805-145  Color: Blue  [LED_0805_WE]
L601#2  782853561  [L_Ferrite_bead_0805]
R601#2  value 10k  [0805]  (hidden comment: R10k_0805_0.25W)
R602#2  value 10k  [0805]  (hidden comment: R10k_0805_0.25W)
R603  value 10k  [0805]  (hidden comment: R10k_0805_0.25W)
R604  value 10k  [0805]  (hidden comment: R10k_0805_0.25W)
R605  value 10k  [0805]  (hidden comment: R10k_0805_0.25W)
R606  value 10k  [0805]  (hidden comment: R10k_0805_0.25W)
R607  value 10k  [0805]  (hidden comment: R10k_0805_0.25W)
R608  value 10k  [0805]  (hidden comment: R10k_0805_0.25W)
R609  R470 0805  [R0805FTK]
R610  R470 0805  [R0805FTK]
R611  R470 0805  [R0805FTK]
R612  R470 0805  [R0805FTK]
U601#2  STM32F105VCT6  [STM-LQFP100_L]  (parts A,B of 2)
Y601  830030819  [WE-XTAL_CFPX-104]

### Blocks framed on the sheet
Identifier resistors: R601#2 R602#2 R603-R608
Analog supply: C601#2 C602#2 L601#2
User LEDs: D601#2 D602#2 D603 D604 R609-R612
MCU Decoupling: C603#2 C604#2 C605#2 C606#2 C607#2
XTAL: C608#2 C609 Y601

### Ports
CAN1_RX (in), CAN1_TX (out), CELL1_LED1 (out), CELL1_LED2 (out), CELL2_LED1 (out), CELL2_LED2 (out), CH1_INT (in), CH2_INT (in), CS_3V3 (out), CSense1 (in), CSense2 (in), DAC_OUT1 (out), DAC_OUT2 (out), DCH_NTC1_ADC (in), DCH_NTC2_ADC (in), GND (bidir), I2C1_SCL (bidir), I2C1_SDA (bidir), I2C2_SCL (bidir), I2C2_SDA (bidir), K11 (out), K12 (out), K21 (out), K22 (out), MISO_3V3 (in), MOSI_3V3 (out), NRST, NTC1 (in), NTC2 (in), SCLK_3V3 (out), SWCLK, SWDIO, VCC_3V3 (in)

### Nets
3V3_A: C602#2.2 L601#2.2 U601#2.21(VREF+) U601#2.22(VDDA)
3V3_MCU: C601#2.2 C603#2.2 C604#2.2 C605#2.2 C606#2.2 C607#2.2 L601#2.1 U601#2.6(VBAT) U601#2.11(VDD_5) U601#2.28(VDD_4) U601#2.50(VDD_1) U601#2.75(VDD_2) U601#2.100(VDD_3) ; port VCC_3V3  [project net +3.3V]
+3V3: R601#2.2 R602#2.2 R603.2 R604.2
GND: C601#2.1 C602#2.1 C603#2.1 C604#2.1 C605#2.1 C606#2.1 C607#2.1 C608#2.2 C609.2 D601#2.K D602#2.K D603.K D604.K R605.1 R606.1 R607.1 R608.1 U601#2.10(VSS_5) U601#2.19(VSSA) U601#2.20(VREF-) U601#2.27(VSS_4) U601#2.49(VSS_1) U601#2.74(VSS_2) U601#2.99(VSS_3) Y601.2(GND_&_Lid) Y601.4(GND_&_Lid) ; port GND
CELL1_LED1: U601#2.85(PD4) ; port CELL1_LED1
CELL1_LED2: U601#2.84(PD3) ; port CELL1_LED2
CELL2_LED1: U601#2.24(PA1) ; port CELL2_LED1
CELL2_LED2: U601#2.25(PA2) ; port CELL2_LED2
CH1_INT: U601#2.81(PD0) ; port CH1_INT
CH2_INT: U601#2.7(PC13-TAMPER-RTC) ; port CH2_INT
DAC_OUT1: U601#2.29(PA4) ; port DAC_OUT1
DAC_OUT2: U601#2.30(PA5) ; port DAC_OUT2
DCH_NTC1_ADC: U601#2.35(PB0) ; port DCH_NTC1_ADC
DCH_NTC2_ADC: U601#2.36(PB1) ; port DCH_NTC2_ADC
I2C1_SCL: U601#2.92(PB6) ; port I2C1_SCL
I2C1_SDA: U601#2.93(PB7) ; port I2C1_SDA
I2C2_SCL: U601#2.47(PB10) ; port I2C2_SCL
I2C2_SDA: U601#2.48(PB11) ; port I2C2_SDA
ID1: R601#2.1 R605.2 U601#2.63(PC6)
ID2: R602#2.1 R606.2 U601#2.64(PC7)
ID3: R603.1 R607.2 U601#2.65(PC8)
ID4: R604.1 R608.2 U601#2.66(PC9)
MCU_ADC_S1: U601#2.34(PC5) ; port CSense1
MCU_ADC_S2: U601#2.16(PC1) ; port CSense2
NRST: U601#2.14(NRST) ; port NRST
SWCLK: U601#2.76(PA14) ; port SWCLK
SWDIO: U601#2.72(PA13) ; port SWDIO
U_LED_1: R609.1 U601#2.38(PE7)
U_LED_2: R610.1 U601#2.39(PE8)
U_LED_3: R611.1 U601#2.40(PE9)
U_LED_4: R612.1 U601#2.41(PE10)
XTAL_IN: C608#2.1 U601#2.12(OSC_IN) Y601.3(Crystal)
XTAL_OUT: C609.1 U601#2.13(OSC_OUT) Y601.1(Crystal)
NetC402_NTC1_2: U601#2.17(PC2) ; port NTC1
NetC402_NTC2_2: U601#2.18(PC3) ; port NTC2
NetD601#2_A: D601#2.A R609.2
NetD602#2_A: D602#2.A R610.2
NetD603_A: D603.A R611.2
NetD604_A: D604.A R612.2
NetR301_KCELL1_1: U601#2.60(PD13) ; port K12
NetR301_KCELL2_1: U601#2.2(PE3) ; port K22
NetR303_KCELL1_1: U601#2.59(PD12) ; port K11
NetR303_KCELL2_1: U601#2.3(PE4) ; port K21
NetU201_2: U601#2.90(PB4) ; port MISO_3V3
NetU201_6: U601#2.89(PB3) ; port SCLK_3V3
NetU201_16: U601#2.77(PA15) ; port CS_3V3
NetU201_18: U601#2.91(PB5) ; port MOSI_3V3
NetU601#1_1: U601#2.70(PA11) ; port CAN1_TX
NetU601#1_4: U601#2.71(PA12) ; port CAN1_RX

Not connected (* = marked no-connect by the designer): U601#2 1(PE2)* 4(PE5)* 5(PE6)* 8(PC14-OSC32_IN)* 9(PC15-OSC32_OUT)* 15(PC0)* 23(PA0-WKUP)* 26(PA3)* 31(PA6)* 32(PA7)* 33(PC4)* 37(PB2)* 42(PE11)* 43(PE12)* 44(PE13)* 45(PE14)* 46(PE15)* 51(PB12)* 52(PB13)* 53(PB14)* 54(PB15)* 55(PD8)* 56(PD9)* 57(PD10)* 58(PD11)* 61(PD14)* 62(PD15)* 67(PA8)* 68(PA9)* 69(PA10)* 73(NC)* 78(PC10)* 79(PC11)* 80(PC12)* 82(PD1)* 83(PD2)* 86(PD5)* 87(PD6)* 88(PD7)* 94(BOOT0)* 95(PB8)* 96(PB9)* 97(PE0)* 98(PE1)*

### Notes on the sheet
- Place MCU decoupling capacitors near MCU
- (in symbol Title Block_template) Company:; Project:; Variant:; Size:; Page Contents:; Version:; Department:; Author:; Sheet; of; Checked by:; Date:

### Library data of the parts
*#5 = Title Block_template: Standard Title Block; .Creator: GP; Category: Title Block; .PCBcheck: GP; .SCHcheck: GP; Size: -
C601#2 C602#2 = CMP-00063-3: Cap, 0.1ΜF, 50V, 10%, X7R, 0805; Manufacturer Part Number 1: 885012207098; Manufacturer 1: Wurth Electronics; Value: 100nF; .Creator: DR; ComponentLink2Description: http://www.farnell.com/datasheets/1958498.pdf?src-supplier=Element14; ComponentLink1Description: http://www.farnell.com/datasheets/1958498.pdf?src-supplier=Farnell; Thickness: 0.035inch; ComponentLink1URL: http://www.farnell.com/datasheets/1958498.pdf?src-supplier=Farnell; Min Operating Temperature: -55°C; Packaging: Cut Tape; ComponentLink2URL: http://www.farnell.com/datasheets/1958498.pdf?src-supplier=Element14; Mount: Surface Mount; Voltage Rating (DC): 50V; Tolerance: 10%; Category: Ceramic Capacitors; RoHS: Yes; Width: 0.049inch; Pricing 1: 100=0,10200, 500=0,07100, 2000=0,06100 (GBP); RoHS Compliant: Yes; ComponentLink4Description: http://www.farnell.com/datasheets/1958498.pdf?src-supplier=Newark; Dielectric: X7R; Stock 1: 8000; Length: 0.079inch; ComponentLink3URL: https://katalog.we-online.de/pbs/datasheet/885012207098.pdf?src-supplier=Digi-Key; ComponentLink3Description: https://katalog.we-online.de/pbs/datasheet/885012207098.pdf?src-supplier=Digi-Key; Design Item ID: C100n-50V-0805FNPC-X7R; ComponentLink4URL: http://www.farnell.com/datasheets/1958498.pdf?src-supplier=Newark; REACH SVHC: Unknown; Case Code (Metric): 2012; Voltage Rating: 50V; Max Operating Temperature: 125°C; Source: Passives.SchLib; Case/Package: 0805
C603#2 C604#2 C605#2 C606#2 C607#2 = CMP-00063-1: Cap, 0.1ΜF, 50V, 10%, X7R, 0805; Manufacturer 1: Wurth Electronics; Manufacturer Part Number 1: 885012207098; Value: 100nF; .Creator: DR; Pricing 1: 100=0,10200, 500=0,07100, 2000=0,06100 (GBP); ComponentLink1URL: http://www.farnell.com/datasheets/1958498.pdf?src-supplier=Farnell; Design Item ID: C100n-50V-0805FNPC-X7R; Voltage Rating (DC): 50V; Voltage Rating: 50V; Max Operating Temperature: 125°C; RoHS: Yes; Case Code (Metric): 2012; Mount: Surface Mount; REACH SVHC: Unknown; Stock 1: 8000; Source: Passives.SchLib; Tolerance: 10%; RoHS Compliant: Yes; Dielectric: X7R; ComponentLink2Description: http://www.farnell.com/datasheets/1958498.pdf?src-supplier=Element14; ComponentLink2URL: http://www.farnell.com/datasheets/1958498.pdf?src-supplier=Element14; Min Operating Temperature: -55°C; Width: 0.049inch; Category: Ceramic Capacitors; Thickness: 0.035inch; Length: 0.079inch; ComponentLink3URL: https://katalog.we-online.de/pbs/datasheet/885012207098.pdf?src-supplier=Digi-Key; Case/Package: 0805; ComponentLink3Description: https://katalog.we-online.de/pbs/datasheet/885012207098.pdf?src-supplier=Digi-Key; Packaging: Cut Tape; ComponentLink1Description: http://www.farnell.com/datasheets/1958498.pdf?src-supplier=Farnell; ComponentLink4Description: http://www.farnell.com/datasheets/1958498.pdf?src-supplier=Newark; ComponentLink4URL: http://www.farnell.com/datasheets/1958498.pdf?src-supplier=Newark
C608#2 C609 = CMP-001-00012-2: Ceramic Capacitor, Multilayer, Ceramic, 50V, 5% +Tol, 5% -Tol, C0G, 30ppm/Cel TC, 0.00001uF, Surface Mount, 0805. 885012007051; Pins: 2; RoHS Compliant: Yes; Capacitor Type: Ceramic
D601#2 D602#2 D603 D604 = CMP-00129-1: LED BLUE CLEAR 0805 SMD; Manufacturer 1: Wurth Electronics; Manufacturer Part Number 1: 150080BS75000; Lens Style: Clear,Rectangular; Wavelength: 470nm; Forward Voltage: 3.2V; Viewing Angle: 140°; .Creator: GP; Test Current: 20mA; Forward Current: 30mA; Luminous Intensity: 145mcd; ComponentLink2Description: Where buy it; Length: 2mm; RoHS Compliant: Yes; ComponentLink3URL: https://datasheet.ciiva.com/23843/150080bs75000-23843251.pdf?src-supplier=Newark; Min Operating Temperature: -40°C; Stock 1: 7400; Lead Free: Lead Free; Height: 0.7mm; ComponentLink7URL: https://datasheet.ciiva.com/29562/150080bs75000-29562923.pdf?src-supplier=Digi-Key; Case Code (Imperial): 0805; Category: LEDs; Pricing 1: 50=0,19300, 500=0,12900, 1000=0,12200, 2000=0,11700, 4000=0,11100 (USD); ComponentLink4Description: https://datasheet.ciiva.com/22656/1740214-22656954.pdf?src-supplier=Element14; ComponentLink4URL: https://datasheet.ciiva.com/22656/1740214-22656954.pdf?src-supplier=Element14; Packaging: Tape and Reel; ComponentLink1URL: https://www.we-online.com/catalog/datasheet/150080BS75000.pdf; Case/Package: 0805; Mount: Surface Mount; ComponentLink5URL: https://datasheet.ciiva.com/29279/759433-da-01-en-chipled-0805-w-kl-blau-150080bs75000-29279203.pdf?src-supplier=Conrad; ComponentLink1Description: Datasheet; ComponentLink6URL: https://datasheet.ciiva.com/29562/150080bs75000-29562922.pdf?src-supplier=Digi-Key; Dominant Wavelength: 470nm; REACH SVHC: Unknown; Width: 1.25mm; RoHS: Yes; Design Item ID: LEDBS-0805-145; ComponentLink7Description: https://datasheet.ciiva.com/29562/150080bs75000-29562923.pdf?src-supplier=Digi-Key; ComponentLink2URL: https://katalog.we-online.de/en/led/WL-SMCW/150080BS75000; ComponentLink6Description: https://datasheet.ciiva.com/29562/150080bs75000-29562922.pdf?src-supplier=Digi-Key; Max Operating Temperature: 85°C; ComponentLink3Description: https://datasheet.ciiva.com/23843/150080bs75000-23843251.pdf?src-supplier=Newark; Source: Semiconductor.SchLib; Case Code (Metric): 2012; Package Quantity: 4000; ComponentLink5Description: https://datasheet.ciiva.com/29279/759433-da-01-en-chipled-0805-w-kl-blau-150080bs75000-29279203.pdf?src-supplier=Conrad
  D601#2 D602#2 D603: Color: Blue
L601#2 = CMP-00166-1: as L101 on sheet ADC; RoHS: Yes; Case Code (Metric): 1608; ComponentLink6URL: https://datasheet.ciiva.com/3082/l0110s0101blm18e-3082714.pdf?src-supplier=Avnet; ComponentLink7URL: https://datasheet.ciiva.com/6211/l0110s0101blm18e-6211470.pdf?src-supplier=Digi-Key; Width: 0.8mm; ComponentLink6Description: https://datasheet.ciiva.com/3082/l0110s0101blm18e-3082714.pdf?src-supplier=Avnet; Series: BLM18E; Stock 1: 20037; Packaging: Tape and Reel; Max Operating Temperature: 125°C; Case/Package: 0603; ComponentLink8URL: https://datasheet.ciiva.com/6211/l0110s0101blm18e-6211471.pdf?src-supplier=Digi-Key; Case Code (Imperial): 0603; Lead Free: Lead Free; ComponentLink3Description: https://datasheet.ciiva.com/41449/001172267-da-01-en-drossel-0603-330r-1-6x0-8mm-4000st-41449581.pdf?src-supplier=Conrad; Height: 0.8mm; REACH SVHC: No SVHC; ComponentLink1URL: https://datasheet.ciiva.com/1467/5169-1467232.pdf?src-supplier=Element14; Number of Pins: 2; Source: Filter components.SchLib; ComponentLink1Description: https://datasheet.ciiva.com/1467/5169-1467232.pdf?src-supplier=Element14; Depth: 0.8mm; Termination: SMD/SMT; Package Quantity: 1; Min Operating Temperature: -55°C; ComponentLink7Description: https://datasheet.ciiva.com/6211/l0110s0101blm18e-6211470.pdf?src-supplier=Digi-Key; Design Item ID: L_Ferrite_bead_782853561; Length: 1.6mm; ComponentLink4Description: https://datasheet.ciiva.com/1467/5169-1467233.pdf?src-supplier=Element14; ComponentLink8Description: https://datasheet.ciiva.com/6211/l0110s0101blm18e-6211471.pdf?src-supplier=Digi-Key; Current Rating: 500mA; RoHS Compliant: Yes; ComponentLink2Description: https://datasheet.ciiva.com/11795/0900766b811b5866-11795405.pdf?src-supplier=RSComponents; Number of Lines: 1; ComponentLink2URL: https://datasheet.ciiva.com/11795/0900766b811b5866-11795405.pdf?src-supplier=RSComponents; Pricing 1: 1=0,23000, 10=0,17500, 25=0,14520, 50=0,12520, 100=0,11260, 250=0,09508, 500=0,08508, 1000=0,07257 (USD); Max Current Rating: 500mA; ComponentLink5URL: https://datasheet.ciiva.com/1561/5169-1561345.pdf?src-supplier=Newark; ComponentLink4URL: https://datasheet.ciiva.com/1467/5169-1467233.pdf?src-supplier=Element14; Category: Ferrite Beads and Chips; ComponentLink3URL: https://datasheet.ciiva.com/41449/001172267-da-01-en-drossel-0603-330r-1-6x0-8mm-4000st-41449581.pdf?src-supplier=Conrad; ComponentLink5Description: https://datasheet.ciiva.com/1561/5169-1561345.pdf?src-supplier=Newark
R601#2 R602#2 R603-R608 = CMP-009-00035-3: Resistor, 10K, 0.25W, Thick Film, 0805 Rohs Compliant: Yes
R609-R612 = CMP-00093-1: Res Thick Film 0805 470 Ohm 1% 1/8W ±100ppm/°C Molded SMD SMD Paper Tape on Plastic Reel; Manufacturer 1: Bourns; Manufacturer Part Number 1: CR0805-FX-4700GLF; Max Power Dissipation: 125mW; Voltage Rating: 150V; Value: 470; .Creator: DR; Min Operating Temperature: -55°C; Mount: Surface Mount; Series: CR0805; Termination: SMD/SMT; REACH SVHC: No SVHC; Depth: 1.25mm; RoHS: Yes; ComponentLink3Description: https://datasheet.ciiva.com/22693/1902866-22693247.pdf?src-supplier=Element14; Max Operating Temperature: 155°C; ComponentLink2Description: https://datasheet.ciiva.com/7985/1856384-7985880.pdf?src-supplier=Element14; Resistor Type: Thick Film; Construction: Rectangular; Number of Terminations: 2; Pins: 2; Length: 2mm; Case Code (Metric): 2012; Category: Chip SMD Resistors; Design Item ID: R470-0805FTK; ComponentLink4Description: https://datasheet.ciiva.com/5541/chpreztr-5541930.pdf?src-supplier=Mouser; Pricing 1: 1=0,00990, 10=0,00980, 25=0,00950, 50=0,00940, 100=0,00930, 250=0,00920, 500=0,00910, 1000=0,00890, 3000=0,00870, 6000=0,00860 (USD); ComponentLink4URL: https://datasheet.ciiva.com/5541/chpreztr-5541930.pdf?src-supplier=Mouser; Tolerance: 1%; Technology: THICK FILM; Packaging: Tape and Reel; Military Standard: Not; Temperature Coefficient: 100ppm/°C; Height: 0.5mm; Thickness: 508um; Stock 1: 12623; Contact Plating: Tin; Case/Package: 0805; Features: Moisture Resistant; ComponentLink1Description: https://datasheet.ciiva.com/11808/0900766b80fcdb72-11808686.pdf?src-supplier=RSComponents; ComponentLink3URL: https://datasheet.ciiva.com/22693/1902866-22693247.pdf?src-supplier=Element14; Voltage Rating (DC): 150V; Power Rating: 125mW; ComponentLink1URL: https://datasheet.ciiva.com/11808/0900766b80fcdb72-11808686.pdf?src-supplier=RSComponents; Resistance Tolerance: 1%; ComponentLink2URL: https://datasheet.ciiva.com/7985/1856384-7985880.pdf?src-supplier=Element14; Radiation Hardening: No; Source: Passives.SchLib
U601#2 = CMP-031-00011-1: RISC Microcontroller, 32-Bit, FLASH, CORTEX-M3 CPU, 72MHz, CMOS, PQFP100; Max Supply Voltage: 3.6V; Min Supply Voltage: 2V; Case/Package: LFQFP; RoHS Compliant: Yes; Max Operating Temperature: 85°C; Pins: 100; Min Operating Temperature: -40°C
Y601 = CMP-003-00000-1: WE-XTAL Quartz Crystal, SMT, CFPX-104, 16MHz, +/-50ppm; Manufacturer: Wurth Elektronik; Load Capacitance: 18pF; ComponentLink2Description: Datasheet Link; Manufacturer Part Number: 830030819; Match Code: WE-XTAL; ComponentLink1Description: Website Link; Width: 3.2mm; Source: WE-XTAL.SchLib; Category: Crystals; Mount: Surface Mount; Frequency: 16MHz; Operating Temperature Max: 60°C; Frequency Tolerance: +/-50ppm; Pins: 4; Design Item ID: 830030819; Component Type: Standard; Length: 5mm; Height: 1mm; Frequency Stability: +/-50ppm; Operating Temperature Min: -10°C; ComponentLink2URL: https://www.we-online.com/redexpert/spec/830030819?ad; ComponentLink1URL: https://www.we-online.com/redexpert/article/830030819?ad; Packaging: Tape and Reel; Case/Package: CFPX-104